# Altium project Jinkono Module.PrjPcb (part 1 of 2)
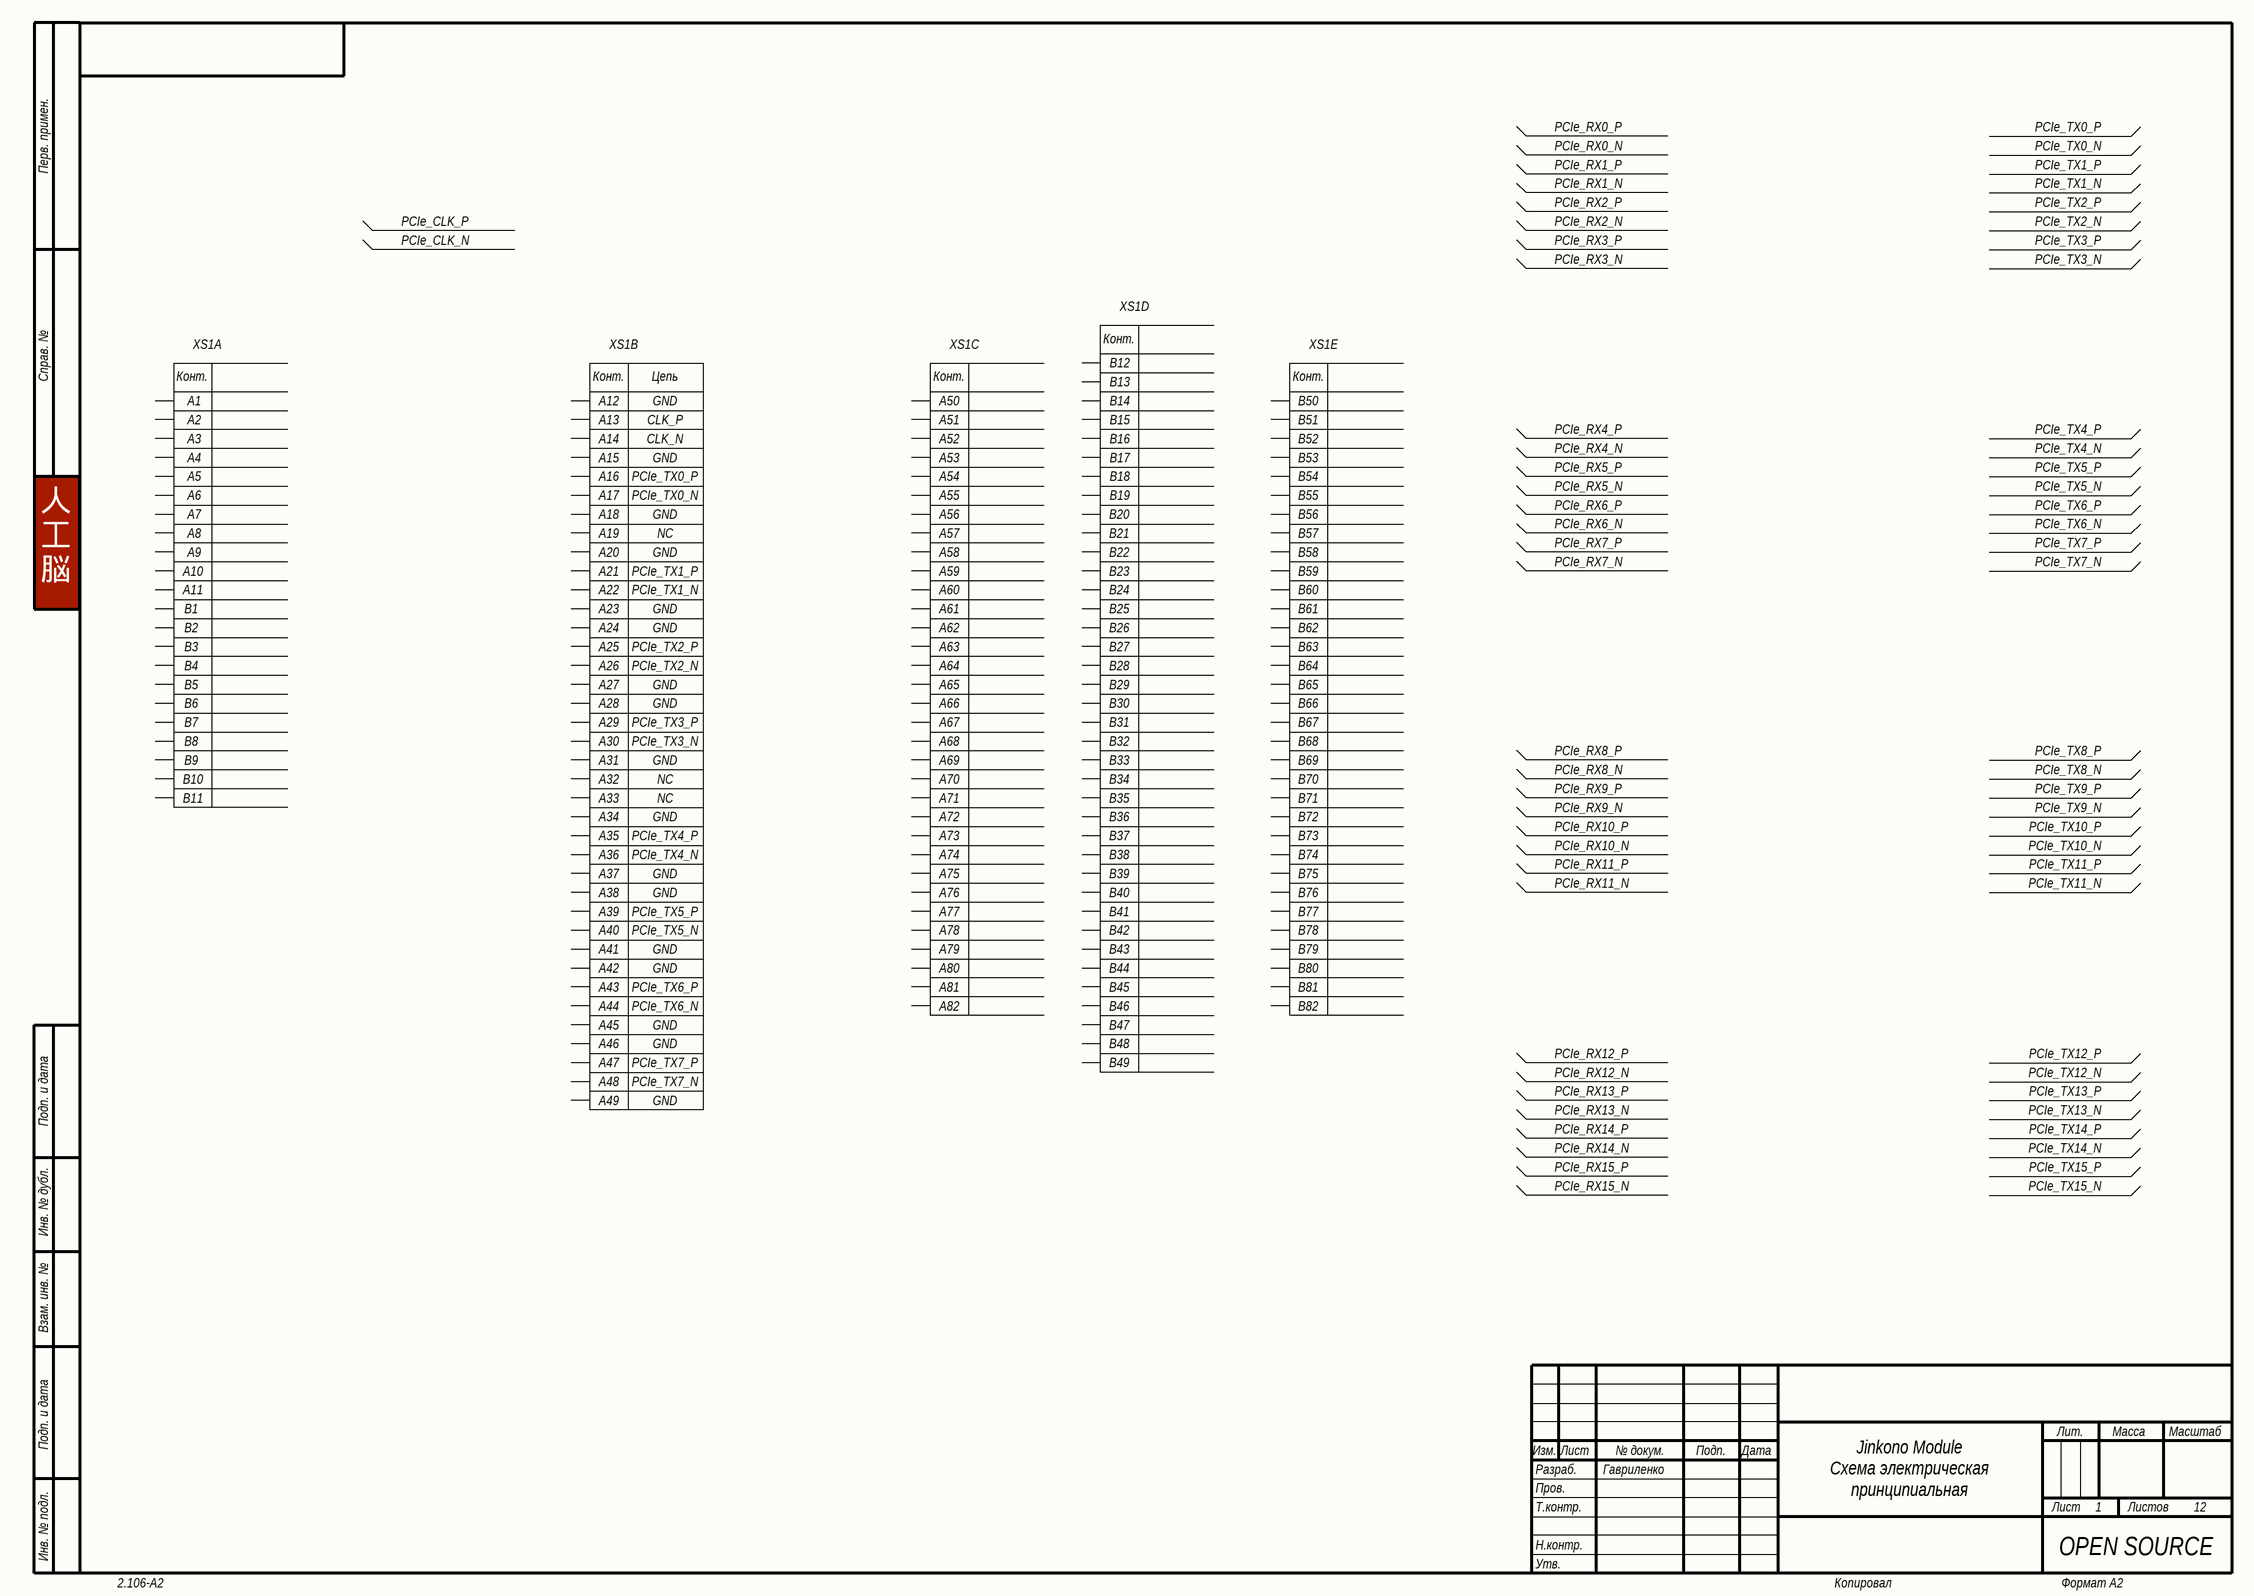
[diagram p0: Э3-1.SchDoc]
11 sheets, 157 parts. Net scope: global (net labels, ports and power ports of the same name join across sheets).
Board file: Jinkono Module вер.0.0.PcbDoc
Sheets:
  Э3-1.SchDoc
  Э3-2.SchDoc
  Э3-3.SchDoc
  Э3-4.SchDoc
  Э3-6.SchDoc
  Э3-7.SchDoc
  Э3-8.SchDoc
  Э3-9.SchDoc
  Э3-10.SchDoc
  Э3-11.SchDoc
  Э3-12.SchDoc

## Sheet Э3-1.SchDoc
size 594 x 420 mm; Author: Гавриленко; CompanyName: OPEN SOURCE; Address1: Address1; Address2: Address2; Address3: Address3; Address4: Address4; SheetNumber: 1; SheetTotal: 12; DocumentType: Схема электрическая принципиальная

### Parts
XS1  1  [PCIe x16 Board Edge Connector]  (value not drawn)  (parts A,B,C,D,E of 5)

### Nets

Not connected (* = marked no-connect by the designer): XS1 A1 A2 A3 A4 A5 A6 A7 A8 A9 A10 A11 A12 A13 A14 A15 A16 A17 A18 A19 A20 A21 A22 A23 A24 A25 A26 A27 A28 A29 A30 A31 A32 A33 A34 A35 A36 A37 A38 A39 A40 A41 A42 A43 A44 A45 A46 A47 A48 A49 A50 A51 A52 A53 A54 A55 A56 A57 A58 A59 A60 A61 A62 A63 A64 A65 A66 A67 A68 A69 A70 A71 A72 A73 A74 A75 A76 A77 A78 A79 A80 A81 A82 B1 B2 B3 B4 B5 B6 B7 B8 B9 B10 B11 B12 B13 B14 B15 B16 B17 B18 B19 B20 B21 B22 B23 B24 B25 B26 B27 B28 B29 B30 B31 B32 B33 B34 B35 B36 B37 B38 B39 B40 B41 B42 B43 B44 B45 B46 B47 B48 B49 B50 B51 B52 B53 B54 B55 B56 B57 B58 B59 B60 B61 B62 B63 B64 B65 B66 B67 B68 B69 B70 B71 B72 B73 B74 B75 B76 B77 B78 B79 B80 B81 B82

### Notes on the sheet
- GND
- Цепь
- CLK_P
- CLK_N
- PCIe_TX0_P
- PCIe_TX0_N
- NC
- PCIe_TX1_P
- PCIe_TX1_N
- 人
  工
  脳
- PCIe_TX2_P
- PCIe_TX2_N
- PCIe_TX3_P
- PCIe_TX3_N
- PCIe_TX4_P
- PCIe_TX4_N
- PCIe_TX5_P
- PCIe_TX5_N
- PCIe_TX6_P
- PCIe_TX6_N
- PCIe_TX7_P
- PCIe_TX7_N
- Jinkono Module
  Схема электрическая
  принципиальная
- Перв. примен.
- Справ. №
- Подп. и дата
- Инв. № дубл.
- Взам. инв. №
- Разраб.
- Изм.
- Лист
- № докум.
- Подп.
- Дата
- Лит.
- Масса
- Масштаб
- Пров.
- Т.контр.
- Листов
- Инв. № подл.
- Утв.
- Н.контр.
- 2.106-A2
- Копировал
- Формат А2
- (in symbol XP_PCe_x16, part A) Конт.
- (in symbol XP_PCe_x16, part B) Конт.
- (in symbol XP_PCe_x16, part C) Конт.
- (in symbol XP_PCe_x16, part D) Конт.
- (in symbol XP_PCe_x16, part E) Конт.

### Library data of the parts
XS1 = XP_PCe_x16: TemperatureRange: -...+°C; ComponentType: Вилка; Install: 1

## Sheet Э3-2.SchDoc
size 594 x 420 mm; Address1: Address1; Address2: Address2; Address3: Address3; Address4: Address4; SheetNumber: 2; SheetTotal: 12; DocumentType: Схема электрическая принципиальная; FirstReferrence: АБВГ.123456.001
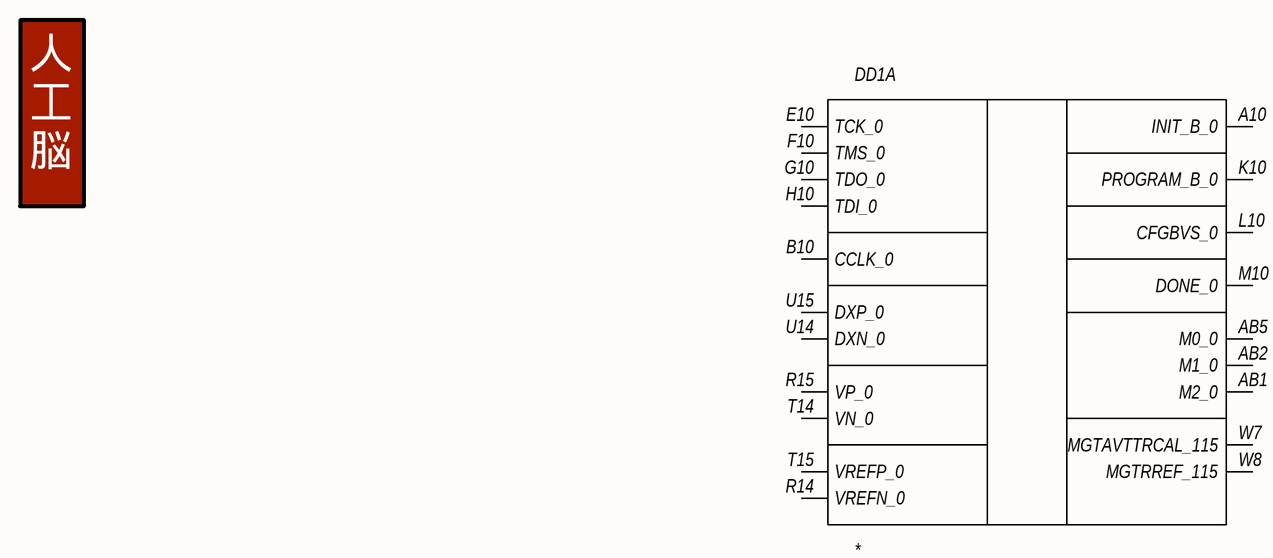
[diagram p1: Э3-2.SchDoc]

### Parts
DD1  *  [FF900/FFG900]  (value not drawn)  (part A of 19)

### Nets

Not connected (* = marked no-connect by the designer): DD1 A10(INIT_B_0) AB1(M2_0) AB2(M1_0) AB5(M0_0) B10(CCLK_0) E10(TCK_0) F10(TMS_0) G10(TDO_0) H10(TDI_0) K10(PROGRAM_B_0) L10(CFGBVS_0) M10(DONE_0) R14(VREFN_0) R15(VP_0) T14(VN_0) T15(VREFP_0) U14(DXN_0) U15(DXP_0) W7(MGTAVTTRCAL_115) W8(MGTRREF_115)

### Notes on the sheet
- 人
  工
  脳
- Перв. примен.
- Справ. №
- Подп. и дата
- Инв. № дубл.
- Взам. инв. №
- Инв. № подл.
- Изм.
- Лист
- № докум.
- Подп.
- Дата
- 2.106-A2
- Копировал
- Формат А2

### Library data of the parts
DD1 = XC7K325T-XFFG900: Kintex-7 FPGA; Manufacturer: Xilinx Inc.; TemperatureRange: -XX...+XX°C; Package: 900-FFG; ComponentType: IC; DatasheetURL: *; HelpURL: *; PinCount: 900; PartNumber: *

## Sheet Э3-3.SchDoc
size 594 x 420 mm; Address1: Address1; Address2: Address2; Address3: Address3; Address4: Address4; SheetNumber: 3; SheetTotal: 12; DocumentType: Схема электрическая принципиальная
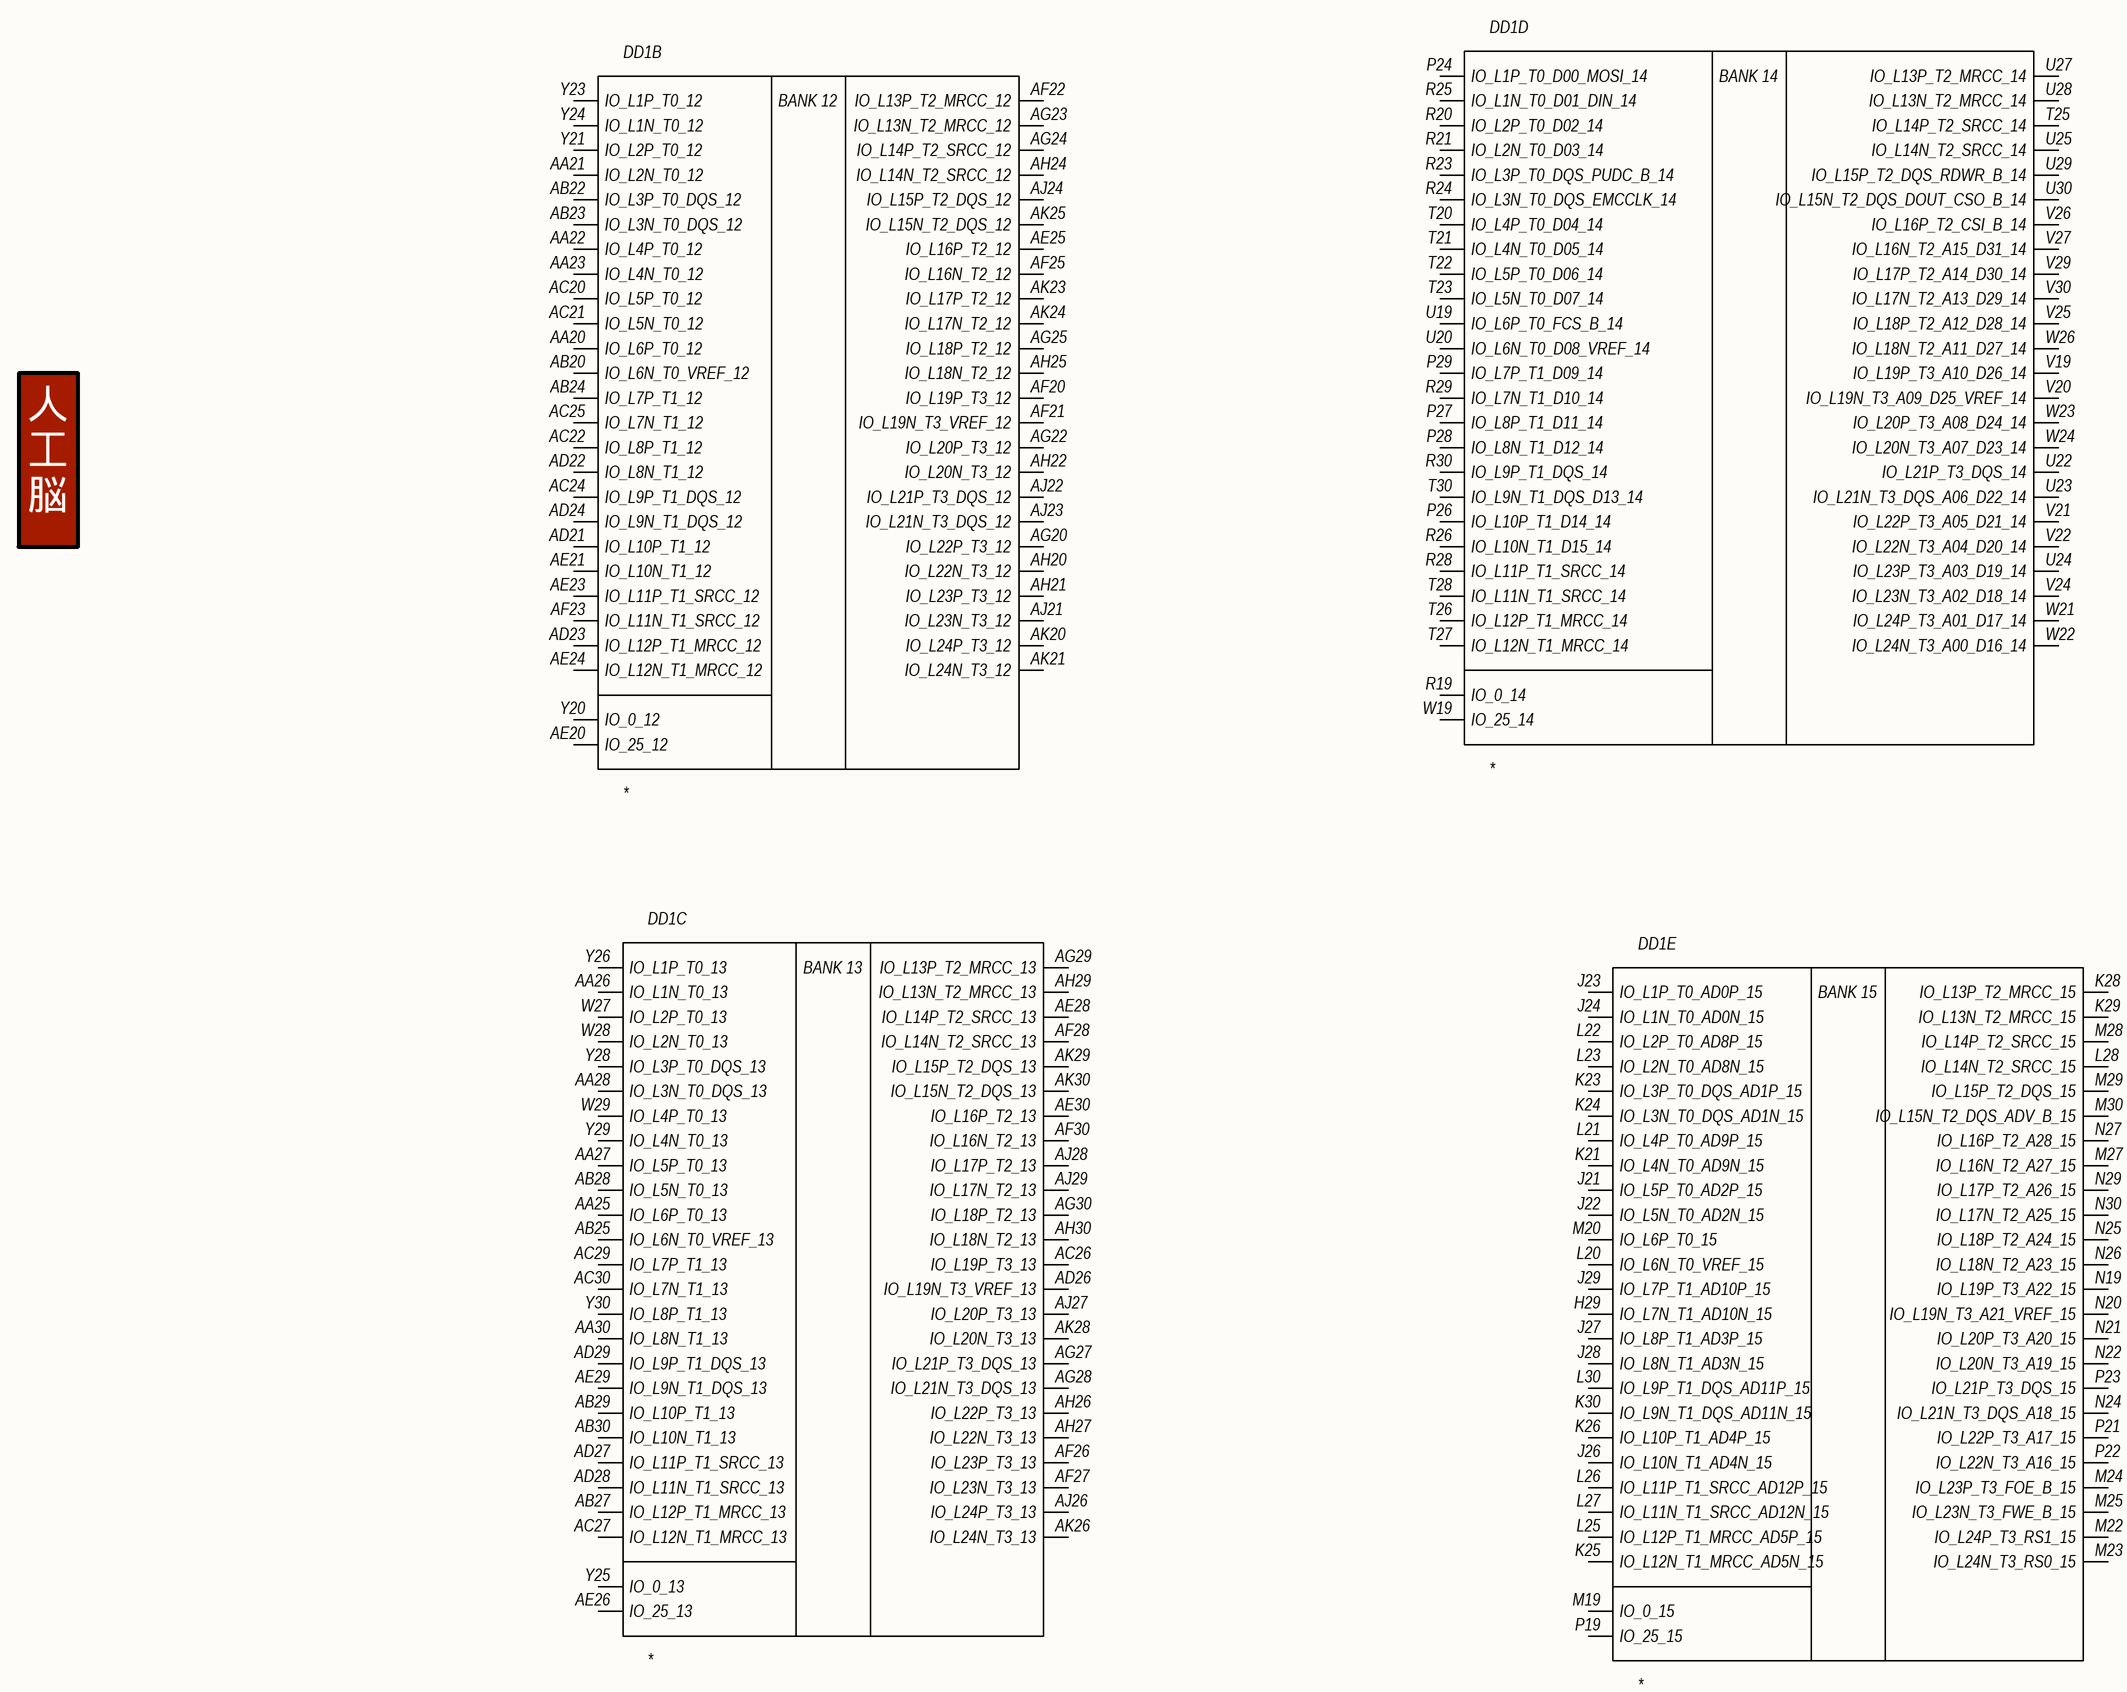
[diagram p2: Э3-3.SchDoc]

### Parts
DD1  *  [FF900/FFG900]  (value not drawn)  (parts B,C,D,E of 19)

### Nets

Not connected (* = marked no-connect by the designer): DD1 AA20(IO_L6P_T0_12) AA21(IO_L2N_T0_12) AA22(IO_L4P_T0_12) AA23(IO_L4N_T0_12) AA25(IO_L6P_T0_13) AA26(IO_L1N_T0_13) AA27(IO_L5P_T0_13) AA28(IO_L3N_T0_DQS_13) AA30(IO_L8N_T1_13) AB20(IO_L6N_T0_VREF_12) AB22(IO_L3P_T0_DQS_12) AB23(IO_L3N_T0_DQS_12) AB24(IO_L7P_T1_12) AB25(IO_L6N_T0_VREF_13) AB27(IO_L12P_T1_MRCC_13) AB28(IO_L5N_T0_13) AB29(IO_L10P_T1_13) AB30(IO_L10N_T1_13) AC20(IO_L5P_T0_12) AC21(IO_L5N_T0_12) AC22(IO_L8P_T1_12) AC24(IO_L9P_T1_DQS_12) AC25(IO_L7N_T1_12) AC26(IO_L19P_T3_13) AC27(IO_L12N_T1_MRCC_13) AC29(IO_L7P_T1_13) AC30(IO_L7N_T1_13) AD21(IO_L10P_T1_12) AD22(IO_L8N_T1_12) AD23(IO_L12P_T1_MRCC_12) AD24(IO_L9N_T1_DQS_12) AD26(IO_L19N_T3_VREF_13) AD27(IO_L11P_T1_SRCC_13) AD28(IO_L11N_T1_SRCC_13) AD29(IO_L9P_T1_DQS_13) AE20(IO_25_12) AE21(IO_L10N_T1_12) AE23(IO_L11P_T1_SRCC_12) AE24(IO_L12N_T1_MRCC_12) AE25(IO_L16P_T2_12) AE26(IO_25_13) AE28(IO_L14P_T2_SRCC_13) AE29(IO_L9N_T1_DQS_13) AE30(IO_L16P_T2_13) AF20(IO_L19P_T3_12) AF21(IO_L19N_T3_VREF_12) AF22(IO_L13P_T2_MRCC_12) AF23(IO_L11N_T1_SRCC_12) AF25(IO_L16N_T2_12) AF26(IO_L23P_T3_13) AF27(IO_L23N_T3_13) AF28(IO_L14N_T2_SRCC_13) AF30(IO_L16N_T2_13) AG20(IO_L22P_T3_12) AG22(IO_L20P_T3_12) AG23(IO_L13N_T2_MRCC_12) AG24(IO_L14P_T2_SRCC_12) AG25(IO_L18P_T2_12) AG27(IO_L21P_T3_DQS_13) AG28(IO_L21N_T3_DQS_13) AG29(IO_L13P_T2_MRCC_13) AG30(IO_L18P_T2_13) AH20(IO_L22N_T3_12) AH21(IO_L23P_T3_12) AH22(IO_L20N_T3_12) AH24(IO_L14N_T2_SRCC_12) AH25(IO_L18N_T2_12) AH26(IO_L22P_T3_13) AH27(IO_L22N_T3_13) AH29(IO_L13N_T2_MRCC_13) AH30(IO_L18N_T2_13) AJ21(IO_L23N_T3_12) AJ22(IO_L21P_T3_DQS_12) AJ23(IO_L21N_T3_DQS_12) AJ24(IO_L15P_T2_DQS_12) AJ26(IO_L24P_T3_13) AJ27(IO_L20P_T3_13) AJ28(IO_L17P_T2_13) AJ29(IO_L17N_T2_13) AK20(IO_L24P_T3_12) AK21(IO_L24N_T3_12) AK23(IO_L17P_T2_12) AK24(IO_L17N_T2_12) AK25(IO_L15N_T2_DQS_12) AK26(IO_L24N_T3_13) AK28(IO_L20N_T3_13) AK29(IO_L15P_T2_DQS_13) AK30(IO_L15N_T2_DQS_13) H29(IO_L7N_T1_AD10N_15) J21(IO_L5P_T0_AD2P_15) J22(IO_L5N_T0_AD2N_15) J23(IO_L1P_T0_AD0P_15) J24(IO_L1N_T0_AD0N_15) J26(IO_L10N_T1_AD4N_15) J27(IO_L8P_T1_AD3P_15) J28(IO_L8N_T1_AD3N_15) J29(IO_L7P_T1_AD10P_15) K21(IO_L4N_T0_AD9N_15) K23(IO_L3P_T0_DQS_AD1P_15) K24(IO_L3N_T0_DQS_AD1N_15) K25(IO_L12N_T1_MRCC_AD5N_15) K26(IO_L10P_T1_AD4P_15) K28(IO_L13P_T2_MRCC_15) K29(IO_L13N_T2_MRCC_15) K30(IO_L9N_T1_DQS_AD11N_15) L20(IO_L6N_T0_VREF_15) L21(IO_L4P_T0_AD9P_15) L22(IO_L2P_T0_AD8P_15) L23(IO_L2N_T0_AD8N_15) L25(IO_L12P_T1_MRCC_AD5P_15) L26(IO_L11P_T1_SRCC_AD12P_15) L27(IO_L11N_T1_SRCC_AD12N_15) L28(IO_L14N_T2_SRCC_15) L30(IO_L9P_T1_DQS_AD11P_15) M19(IO_0_15) M20(IO_L6P_T0_15) M22(IO_L24P_T3_RS1_15) M23(IO_L24N_T3_RS0_15) M24(IO_L23P_T3_FOE_B_15) M25(IO_L23N_T3_FWE_B_15) M27(IO_L16N_T2_A27_15) M28(IO_L14P_T2_SRCC_15) M29(IO_L15P_T2_DQS_15) M30(IO_L15N_T2_DQS_ADV_B_15) N19(IO_L19P_T3_A22_15) N20(IO_L19N_T3_A21_VREF_15) N21(IO_L20P_T3_A20_15) N22(IO_L20N_T3_A19_15) N24(IO_L21N_T3_DQS_A18_15) N25(IO_L18P_T2_A24_15) N26(IO_L18N_T2_A23_15) N27(IO_L16P_T2_A28_15) N29(IO_L17P_T2_A26_15) N30(IO_L17N_T2_A25_15) P19(IO_25_15) P21(IO_L22P_T3_A17_15) P22(IO_L22N_T3_A16_15) P23(IO_L21P_T3_DQS_15) P24(IO_L1P_T0_D00_MOSI_14) P26(IO_L10P_T1_D14_14) P27(IO_L8P_T1_D11_14) P28(IO_L8N_T1_D12_14) P29(IO_L7P_T1_D09_14) R19(IO_0_14) R20(IO_L2P_T0_D02_14) R21(IO_L2N_T0_D03_14) R23(IO_L3P_T0_DQS_PUDC_B_14) R24(IO_L3N_T0_DQS_EMCCLK_14) R25(IO_L1N_T0_D01_DIN_14) R26(IO_L10N_T1_D15_14) R28(IO_L11P_T1_SRCC_14) R29(IO_L7N_T1_D10_14) R30(IO_L9P_T1_DQS_14) T20(IO_L4P_T0_D04_14) T21(IO_L4N_T0_D05_14) T22(IO_L5P_T0_D06_14) T23(IO_L5N_T0_D07_14) T25(IO_L14P_T2_SRCC_14) T26(IO_L12P_T1_MRCC_14) T27(IO_L12N_T1_MRCC_14) T28(IO_L11N_T1_SRCC_14) T30(IO_L9N_T1_DQS_D13_14) U19(IO_L6P_T0_FCS_B_14) U20(IO_L6N_T0_D08_VREF_14) U22(IO_L21P_T3_DQS_14) U23(IO_L21N_T3_DQS_A06_D22_14) U24(IO_L23P_T3_A03_D19_14) U25(IO_L14N_T2_SRCC_14) U27(IO_L13P_T2_MRCC_14) U28(IO_L13N_T2_MRCC_14) U29(IO_L15P_T2_DQS_RDWR_B_14) U30(IO_L15N_T2_DQS_DOUT_CSO_B_14) V19(IO_L19P_T3_A10_D26_14) V20(IO_L19N_T3_A09_D25_VREF_14) V21(IO_L22P_T3_A05_D21_14) V22(IO_L22N_T3_A04_D20_14) V24(IO_L23N_T3_A02_D18_14) V25(IO_L18P_T2_A12_D28_14) V26(IO_L16P_T2_CSI_B_14) V27(IO_L16N_T2_A15_D31_14) V29(IO_L17P_T2_A14_D30_14) V30(IO_L17N_T2_A13_D29_14) W19(IO_25_14) W21(IO_L24P_T3_A01_D17_14) W22(IO_L24N_T3_A00_D16_14) W23(IO_L20P_T3_A08_D24_14) W24(IO_L20N_T3_A07_D23_14) W26(IO_L18N_T2_A11_D27_14) W27(IO_L2P_T0_13) W28(IO_L2N_T0_13) W29(IO_L4P_T0_13) Y20(IO_0_12) Y21(IO_L2P_T0_12) Y23(IO_L1P_T0_12) Y24(IO_L1N_T0_12) Y25(IO_0_13) Y26(IO_L1P_T0_13) Y28(IO_L3P_T0_DQS_13) Y29(IO_L4N_T0_13) Y30(IO_L8P_T1_13)

### Notes on the sheet
- 人
  工
  脳
- Перв. примен.
- Справ. №
- Подп. и дата
- Инв. № дубл.
- Взам. инв. №
- Инв. № подл.
- Изм.
- Лист
- № докум.
- Подп.
- Дата
- 2.106-A2
- Копировал
- Формат А2
- (in symbol XC7K325T-XFFG900, part B) BANK 12
- (in symbol XC7K325T-XFFG900, part C) BANK 13
- (in symbol XC7K325T-XFFG900, part D) BANK 14
- (in symbol XC7K325T-XFFG900, part E) BANK 15

### Library data of the parts
DD1 = XC7K325T-XFFG900: as DD1 on sheet Э3-2; Package: 900-FFG; ComponentType: IC; DatasheetURL: *; HelpURL: *; PinCount: 900; PartNumber: *

## Sheet Э3-4.SchDoc
size 594 x 420 mm; Address1: Address1; Address2: Address2; Address3: Address3; Address4: Address4; SheetNumber: 4; SheetTotal: 12; DocumentType: Схема электрическая принципиальная
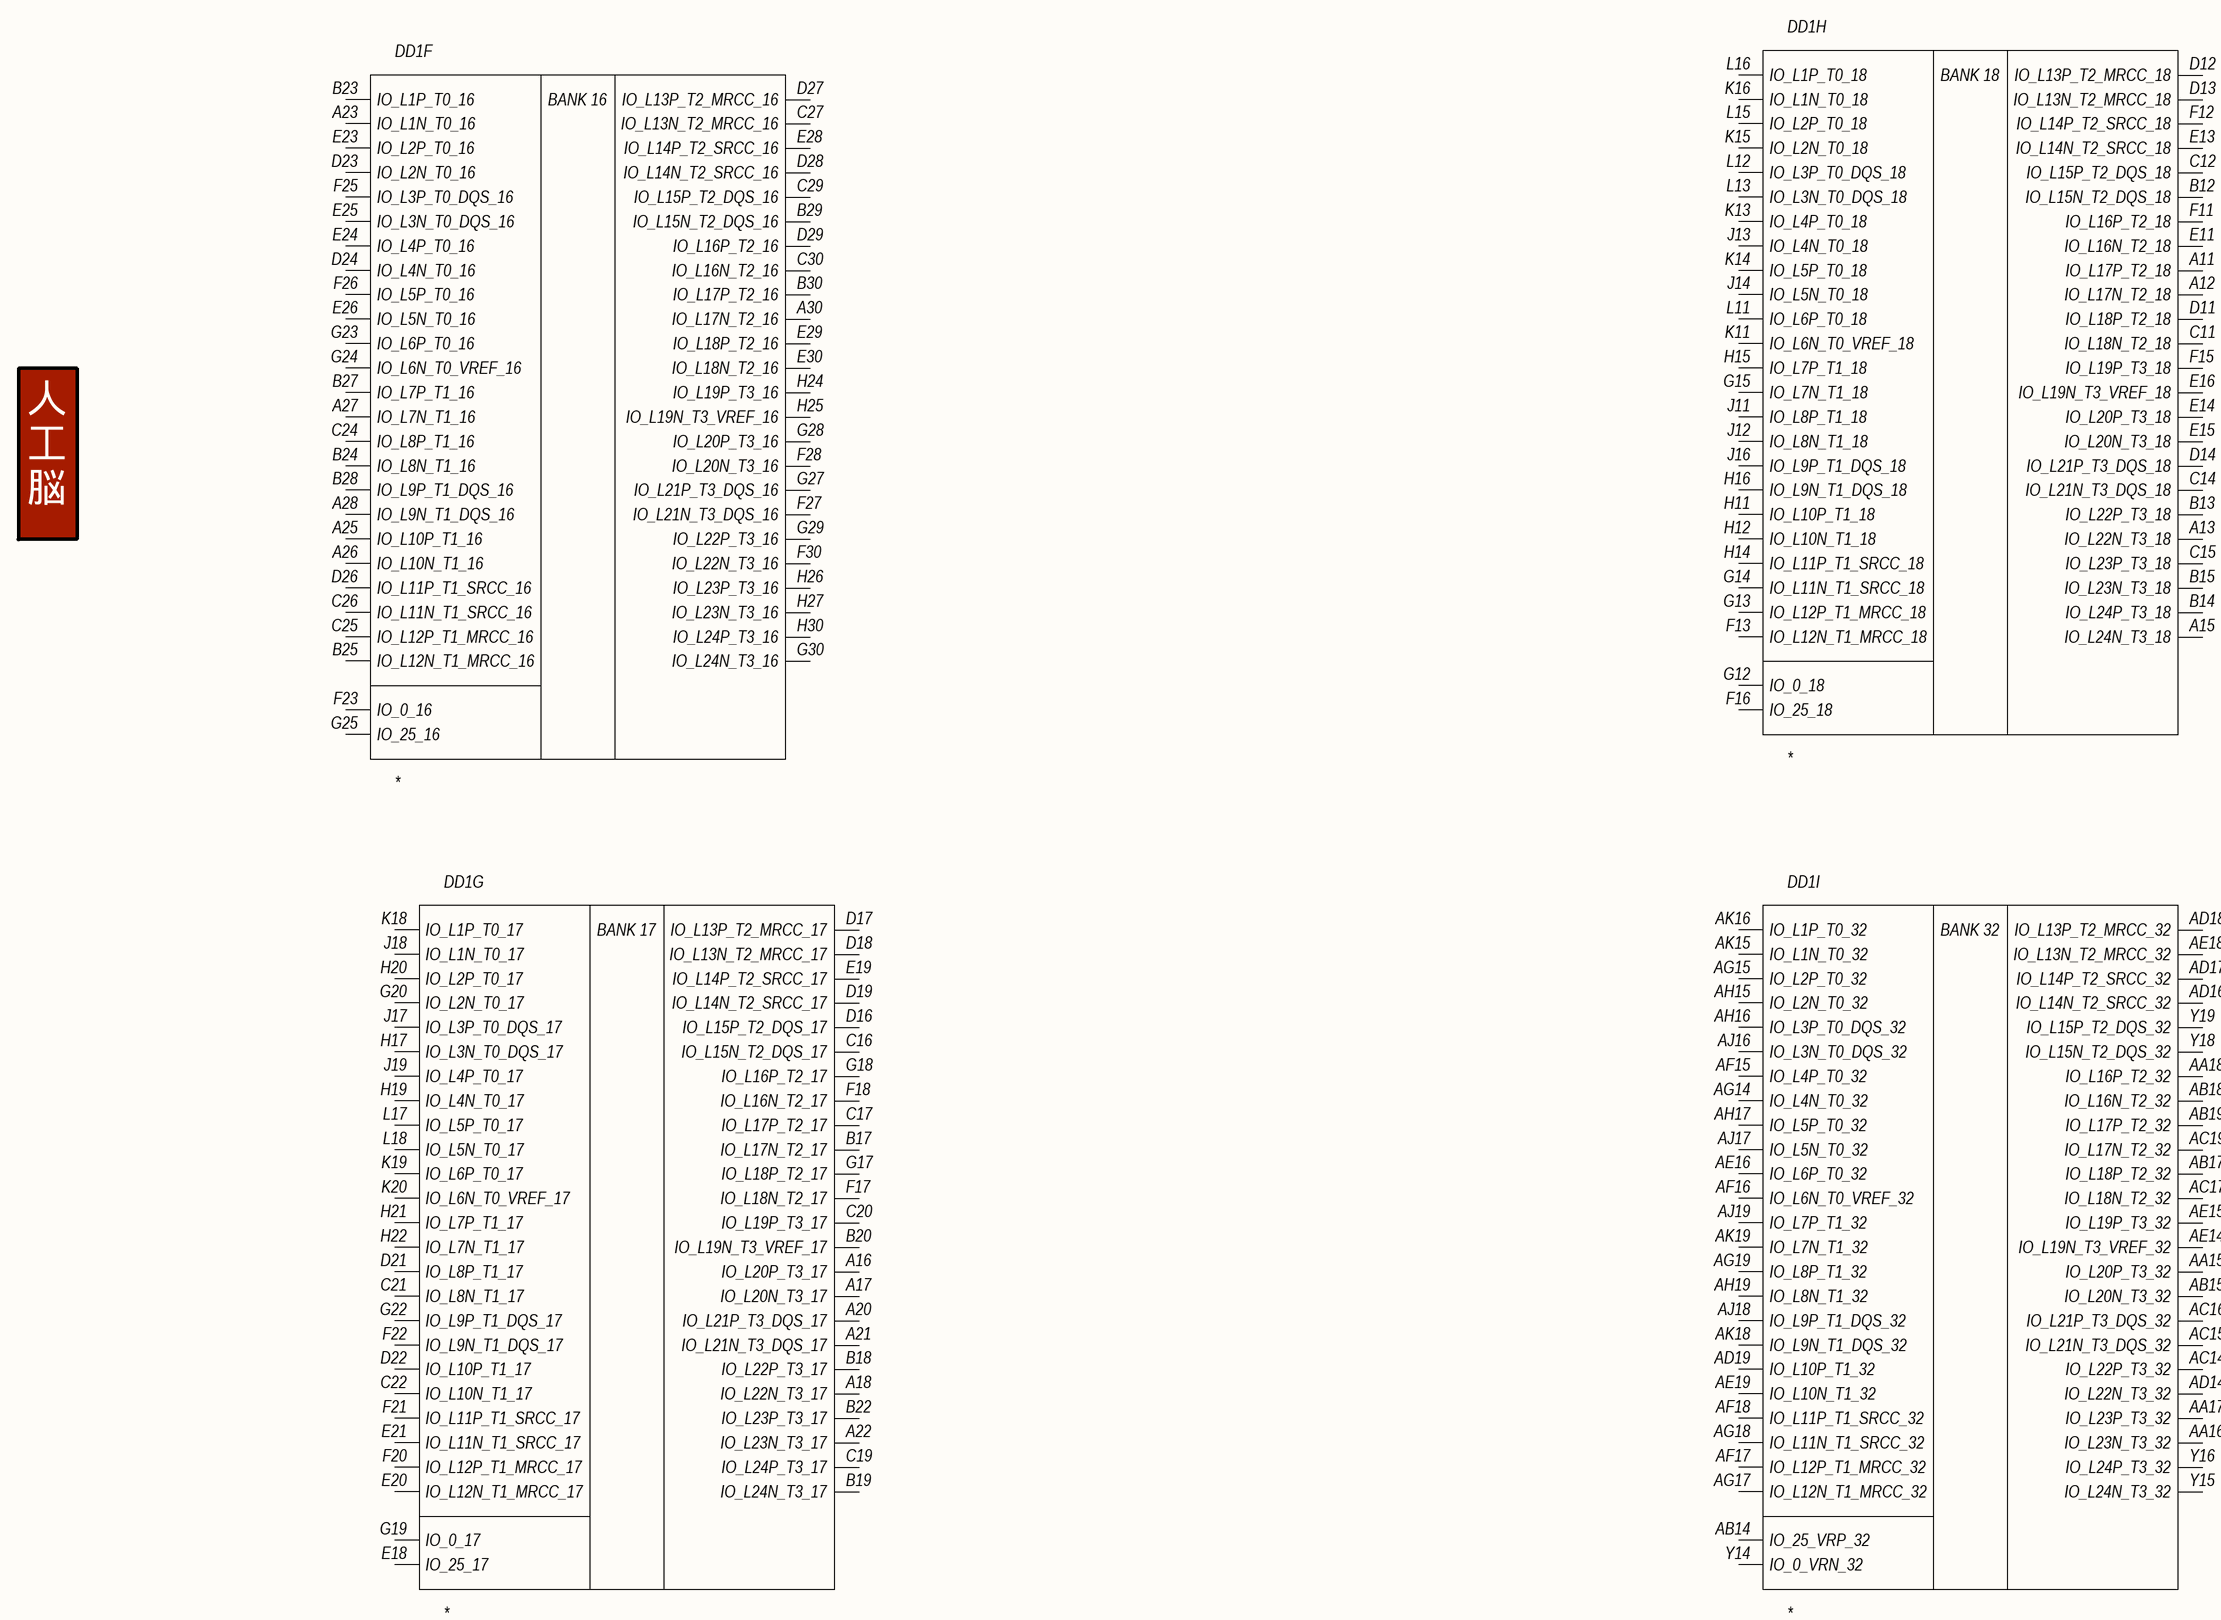
[diagram p3: Э3-4.SchDoc]

### Parts
DD1  *  [FF900/FFG900]  (value not drawn)  (parts F,G,H,I of 19)

### Nets

Not connected (* = marked no-connect by the designer): DD1 A11(IO_L17P_T2_18) A12(IO_L17N_T2_18) A13(IO_L22N_T3_18) A15(IO_L24N_T3_18) A16(IO_L20P_T3_17) A17(IO_L20N_T3_17) A18(IO_L22N_T3_17) A20(IO_L21P_T3_DQS_17) A21(IO_L21N_T3_DQS_17) A22(IO_L23N_T3_17) A23(IO_L1N_T0_16) A25(IO_L10P_T1_16) A26(IO_L10N_T1_16) A27(IO_L7N_T1_16) A28(IO_L9N_T1_DQS_16) A30(IO_L17N_T2_16) AA15(IO_L20P_T3_32) AA16(IO_L23N_T3_32) AA17(IO_L23P_T3_32) AA18(IO_L16P_T2_32) AB14(IO_25_VRP_32) AB15(IO_L20N_T3_32) AB17(IO_L18P_T2_32) AB18(IO_L16N_T2_32) AB19(IO_L17P_T2_32) AC14(IO_L22P_T3_32) AC15(IO_L21N_T3_DQS_32) AC16(IO_L21P_T3_DQS_32) AC17(IO_L18N_T2_32) AC19(IO_L17N_T2_32) AD14(IO_L22N_T3_32) AD16(IO_L14N_T2_SRCC_32) AD17(IO_L14P_T2_SRCC_32) AD18(IO_L13P_T2_MRCC_32) AD19(IO_L10P_T1_32) AE14(IO_L19N_T3_VREF_32) AE15(IO_L19P_T3_32) AE16(IO_L6P_T0_32) AE18(IO_L13N_T2_MRCC_32) AE19(IO_L10N_T1_32) AF15(IO_L4P_T0_32) AF16(IO_L6N_T0_VREF_32) AF17(IO_L12P_T1_MRCC_32) AF18(IO_L11P_T1_SRCC_32) AG14(IO_L4N_T0_32) AG15(IO_L2P_T0_32) AG17(IO_L12N_T1_MRCC_32) AG18(IO_L11N_T1_SRCC_32) AG19(IO_L8P_T1_32) AH15(IO_L2N_T0_32) AH16(IO_L3P_T0_DQS_32) AH17(IO_L5P_T0_32) AH19(IO_L8N_T1_32) AJ16(IO_L3N_T0_DQS_32) AJ17(IO_L5N_T0_32) AJ18(IO_L9P_T1_DQS_32) AJ19(IO_L7P_T1_32) AK15(IO_L1N_T0_32) AK16(IO_L1P_T0_32) AK18(IO_L9N_T1_DQS_32) AK19(IO_L7N_T1_32) B12(IO_L15N_T2_DQS_18) B13(IO_L22P_T3_18) B14(IO_L24P_T3_18) B15(IO_L23N_T3_18) B17(IO_L17N_T2_17) B18(IO_L22P_T3_17) B19(IO_L24N_T3_17) B20(IO_L19N_T3_VREF_17) B22(IO_L23P_T3_17) B23(IO_L1P_T0_16) B24(IO_L8N_T1_16) B25(IO_L12N_T1_MRCC_16) B27(IO_L7P_T1_16) B28(IO_L9P_T1_DQS_16) B29(IO_L15N_T2_DQS_16) B30(IO_L17P_T2_16) C11(IO_L18N_T2_18) C12(IO_L15P_T2_DQS_18) C14(IO_L21N_T3_DQS_18) C15(IO_L23P_T3_18) C16(IO_L15N_T2_DQS_17) C17(IO_L17P_T2_17) C19(IO_L24P_T3_17) C20(IO_L19P_T3_17) C21(IO_L8N_T1_17) C22(IO_L10N_T1_17) C24(IO_L8P_T1_16) C25(IO_L12P_T1_MRCC_16) C26(IO_L11N_T1_SRCC_16) C27(IO_L13N_T2_MRCC_16) C29(IO_L15P_T2_DQS_16) C30(IO_L16N_T2_16) D11(IO_L18P_T2_18) D12(IO_L13P_T2_MRCC_18) D13(IO_L13N_T2_MRCC_18) D14(IO_L21P_T3_DQS_18) D16(IO_L15P_T2_DQS_17) D17(IO_L13P_T2_MRCC_17) D18(IO_L13N_T2_MRCC_17) D19(IO_L14N_T2_SRCC_17) D21(IO_L8P_T1_17) D22(IO_L10P_T1_17) D23(IO_L2N_T0_16) D24(IO_L4N_T0_16) D26(IO_L11P_T1_SRCC_16) D27(IO_L13P_T2_MRCC_16) D28(IO_L14N_T2_SRCC_16) D29(IO_L16P_T2_16) E11(IO_L16N_T2_18) E13(IO_L14N_T2_SRCC_18) E14(IO_L20P_T3_18) E15(IO_L20N_T3_18) E16(IO_L19N_T3_VREF_18) E18(IO_25_17) E19(IO_L14P_T2_SRCC_17) E20(IO_L12N_T1_MRCC_17) E21(IO_L11N_T1_SRCC_17) E23(IO_L2P_T0_16) E24(IO_L4P_T0_16) E25(IO_L3N_T0_DQS_16) E26(IO_L5N_T0_16) E28(IO_L14P_T2_SRCC_16) E29(IO_L18P_T2_16) E30(IO_L18N_T2_16) F11(IO_L16P_T2_18) F12(IO_L14P_T2_SRCC_18) F13(IO_L12N_T1_MRCC_18) F15(IO_L19P_T3_18) F16(IO_25_18) F17(IO_L18N_T2_17) F18(IO_L16N_T2_17) F20(IO_L12P_T1_MRCC_17) F21(IO_L11P_T1_SRCC_17) F22(IO_L9N_T1_DQS_17) F23(IO_0_16) F25(IO_L3P_T0_DQS_16) F26(IO_L5P_T0_16) F27(IO_L21N_T3_DQS_16) F28(IO_L20N_T3_16) F30(IO_L22N_T3_16) G12(IO_0_18) G13(IO_L12P_T1_MRCC_18) G14(IO_L11N_T1_SRCC_18) G15(IO_L7N_T1_18) G17(IO_L18P_T2_17) G18(IO_L16P_T2_17) G19(IO_0_17) G20(IO_L2N_T0_17) G22(IO_L9P_T1_DQS_17) G23(IO_L6P_T0_16) G24(IO_L6N_T0_VREF_16) G25(IO_25_16) G27(IO_L21P_T3_DQS_16) G28(IO_L20P_T3_16) G29(IO_L22P_T3_16) G30(IO_L24N_T3_16) H11(IO_L10P_T1_18) H12(IO_L10N_T1_18) H14(IO_L11P_T1_SRCC_18) H15(IO_L7P_T1_18) H16(IO_L9N_T1_DQS_18) H17(IO_L3N_T0_DQS_17) H19(IO_L4N_T0_17) H20(IO_L2P_T0_17) H21(IO_L7P_T1_17) H22(IO_L7N_T1_17) H24(IO_L19P_T3_16) H25(IO_L19N_T3_VREF_16) H26(IO_L23P_T3_16) H27(IO_L23N_T3_16) H30(IO_L24P_T3_16) J11(IO_L8P_T1_18) J12(IO_L8N_T1_18) J13(IO_L4N_T0_18) J14(IO_L5N_T0_18) J16(IO_L9P_T1_DQS_18) J17(IO_L3P_T0_DQS_17) J18(IO_L1N_T0_17) J19(IO_L4P_T0_17) K11(IO_L6N_T0_VREF_18) K13(IO_L4P_T0_18) K14(IO_L5P_T0_18) K15(IO_L2N_T0_18) K16(IO_L1N_T0_18) K18(IO_L1P_T0_17) K19(IO_L6P_T0_17) K20(IO_L6N_T0_VREF_17) L11(IO_L6P_T0_18) L12(IO_L3P_T0_DQS_18) L13(IO_L3N_T0_DQS_18) L15(IO_L2P_T0_18) L16(IO_L1P_T0_18) L17(IO_L5P_T0_17) L18(IO_L5N_T0_17) Y14(IO_0_VRN_32) Y15(IO_L24N_T3_32) Y16(IO_L24P_T3_32) Y18(IO_L15N_T2_DQS_32) Y19(IO_L15P_T2_DQS_32)

### Notes on the sheet
- 人
  工
  脳
- Перв. примен.
- Справ. №
- Подп. и дата
- Инв. № дубл.
- Взам. инв. №
- Инв. № подл.
- Изм.
- Лист
- № докум.
- Подп.
- Дата
- 2.106-A2
- Копировал
- Формат А2
- (in symbol XC7K325T-XFFG900, part F) BANK 16
- (in symbol XC7K325T-XFFG900, part G) BANK 17
- (in symbol XC7K325T-XFFG900, part H) BANK 18
- (in symbol XC7K325T-XFFG900, part I) BANK 32

### Library data of the parts
DD1 = XC7K325T-XFFG900: as DD1 on sheet Э3-2; Package: 900-FFG; ComponentType: IC; DatasheetURL: *; HelpURL: *; PinCount: 900; PartNumber: *

## Sheet Э3-6.SchDoc
size 594 x 420 mm; Address1: Address1; Address2: Address2; Address3: Address3; Address4: Address4; SheetNumber: 6; SheetTotal: 12; DocumentType: Схема электрическая принципиальная
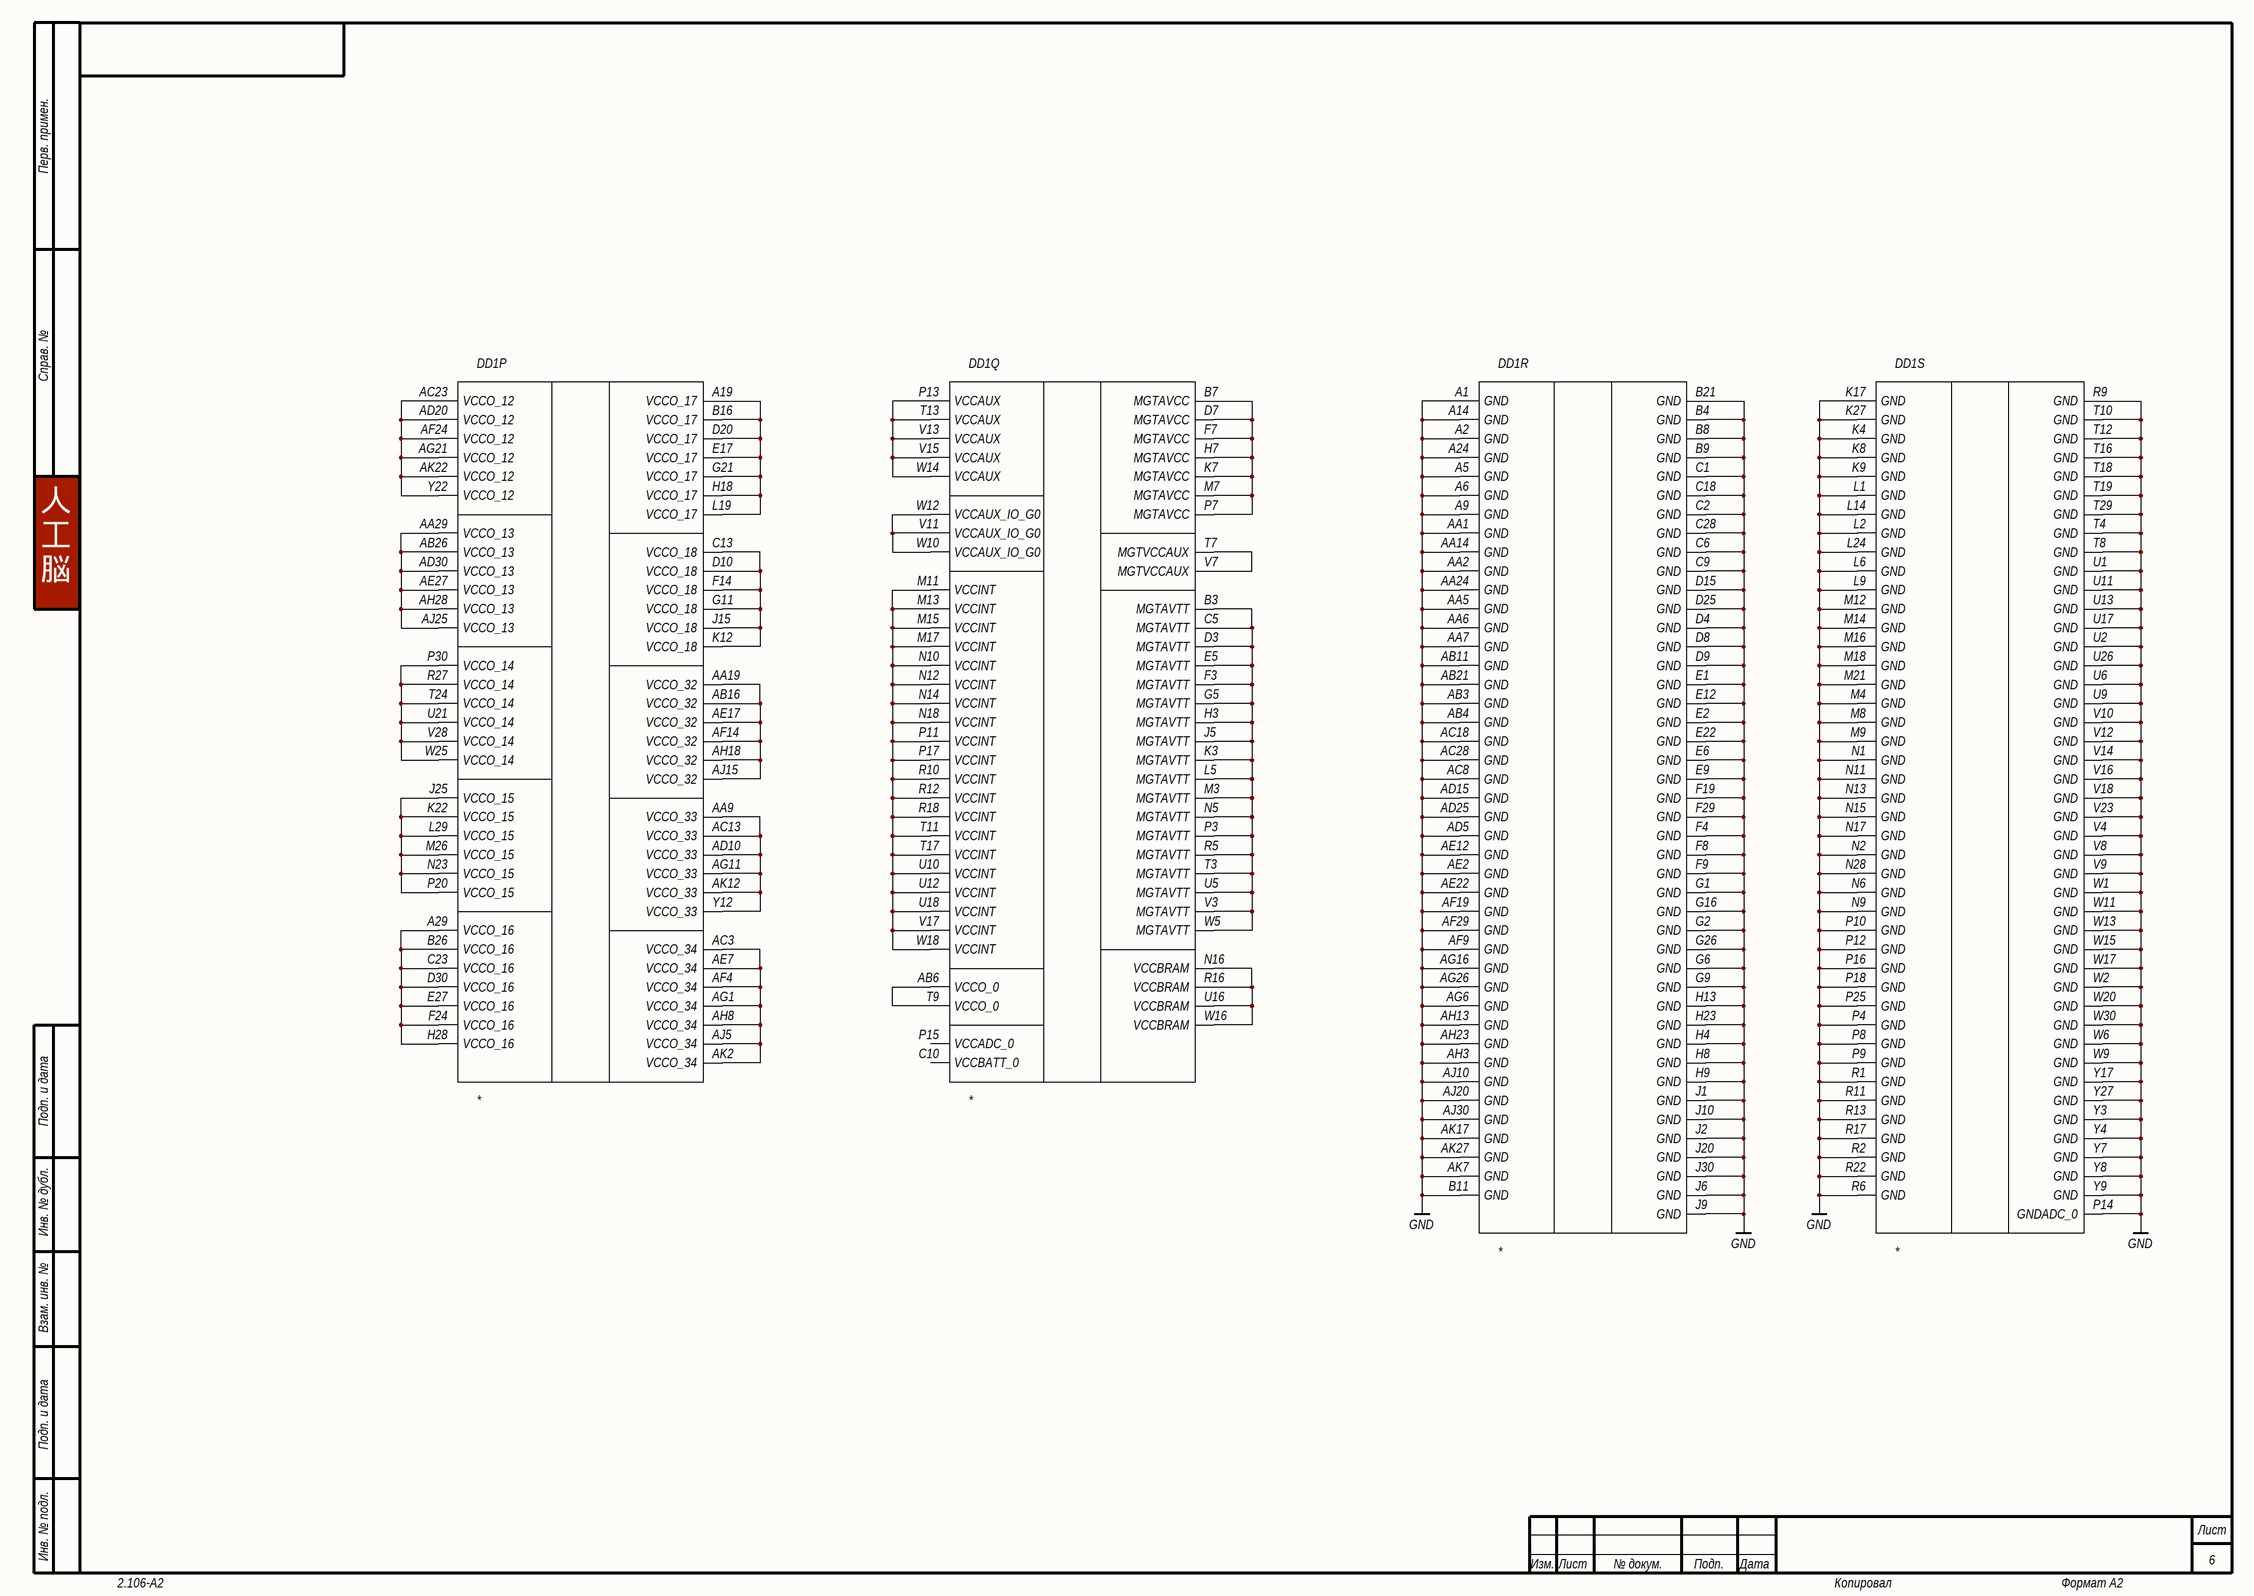
[diagram p4: Э3-6.SchDoc]

### Parts
DD1  *  [FF900/FFG900]  (value not drawn)  (parts P,Q,R,S of 19)

### Nets
GND: DD1.A1(GND) DD1.A2(GND) DD1.A5(GND) DD1.A6(GND) DD1.A9(GND) DD1.A14(GND) DD1.A24(GND) DD1.AA1(GND) DD1.AA2(GND) DD1.AA5(GND) DD1.AA6(GND) DD1.AA7(GND) DD1.AA14(GND) DD1.AA24(GND) DD1.AB3(GND) DD1.AB4(GND) DD1.AB11(GND) DD1.AB21(GND) DD1.AC8(GND) DD1.AC18(GND) DD1.AC28(GND) DD1.AD5(GND) DD1.AD15(GND) DD1.AD25(GND) DD1.AE2(GND) DD1.AE12(GND) DD1.AE22(GND) DD1.AF9(GND) DD1.AF19(GND) DD1.AF29(GND) DD1.AG6(GND) DD1.AG16(GND) DD1.AG26(GND) DD1.AH3(GND) DD1.AH13(GND) DD1.AH23(GND) DD1.AJ10(GND) DD1.AJ20(GND) DD1.AJ30(GND) DD1.AK7(GND) DD1.AK17(GND) DD1.AK27(GND) DD1.B4(GND) DD1.B8(GND) DD1.B9(GND) DD1.B11(GND) DD1.B21(GND) DD1.C1(GND) DD1.C2(GND) DD1.C6(GND) DD1.C9(GND) DD1.C18(GND) DD1.C28(GND) DD1.D4(GND) DD1.D8(GND) DD1.D9(GND) DD1.D15(GND) DD1.D25(GND) DD1.E1(GND) DD1.E2(GND) DD1.E6(GND) DD1.E9(GND) DD1.E12(GND) DD1.E22(GND) DD1.F4(GND) DD1.F8(GND) DD1.F9(GND) DD1.F19(GND) DD1.F29(GND) DD1.G1(GND) DD1.G2(GND) DD1.G6(GND) DD1.G9(GND) DD1.G16(GND) DD1.G26(GND) DD1.H4(GND) DD1.H8(GND) DD1.H9(GND) DD1.H13(GND) DD1.H23(GND) DD1.J1(GND) DD1.J2(GND) DD1.J6(GND) DD1.J9(GND) DD1.J10(GND) DD1.J20(GND) DD1.J30(GND) DD1.K4(GND) DD1.K8(GND) DD1.K9(GND) DD1.K17(GND) DD1.K27(GND) DD1.L1(GND) DD1.L2(GND) DD1.L6(GND) DD1.L9(GND) DD1.L14(GND) DD1.L24(GND) DD1.M4(GND) DD1.M8(GND) DD1.M9(GND) DD1.M12(GND) DD1.M14(GND) DD1.M16(GND) DD1.M18(GND) DD1.M21(GND) DD1.N1(GND) DD1.N2(GND) DD1.N6(GND) DD1.N9(GND) DD1.N11(GND) DD1.N13(GND) DD1.N15(GND) DD1.N17(GND) DD1.N28(GND) DD1.P4(GND) DD1.P8(GND) DD1.P9(GND) DD1.P10(GND) DD1.P12(GND) DD1.P14(GNDADC_0) DD1.P16(GND) DD1.P18(GND) DD1.P25(GND) DD1.R1(GND) DD1.R2(GND) DD1.R6(GND) DD1.R9(GND) DD1.R11(GND) DD1.R13(GND) DD1.R17(GND) DD1.R22(GND) DD1.T4(GND) DD1.T8(GND) DD1.T10(GND) DD1.T12(GND) DD1.T16(GND) DD1.T18(GND) DD1.T19(GND) DD1.T29(GND) DD1.U1(GND) DD1.U2(GND) DD1.U6(GND) DD1.U9(GND) DD1.U11(GND) DD1.U13(GND) DD1.U17(GND) DD1.U26(GND) DD1.V4(GND) DD1.V8(GND) DD1.V9(GND) DD1.V10(GND) DD1.V12(GND) DD1.V14(GND) DD1.V16(GND) DD1.V18(GND) DD1.V23(GND) DD1.W1(GND) DD1.W2(GND) DD1.W6(GND) DD1.W9(GND) DD1.W11(GND) DD1.W13(GND) DD1.W15(GND) DD1.W17(GND) DD1.W20(GND) DD1.W30(GND) DD1.Y3(GND) DD1.Y4(GND) DD1.Y7(GND) DD1.Y8(GND) DD1.Y9(GND) DD1.Y17(GND) DD1.Y27(GND)
NetDD1_A19: DD1.A19(VCCO_17) DD1.B16(VCCO_17) DD1.D20(VCCO_17) DD1.E17(VCCO_17) DD1.G21(VCCO_17) DD1.H18(VCCO_17) DD1.L19(VCCO_17)
NetDD1_A29: DD1.A29(VCCO_16) DD1.B26(VCCO_16) DD1.C23(VCCO_16) DD1.D30(VCCO_16) DD1.E27(VCCO_16) DD1.F24(VCCO_16) DD1.H28(VCCO_16)
NetDD1_AA9: DD1.AA9(VCCO_33) DD1.AC13(VCCO_33) DD1.AD10(VCCO_33) DD1.AG11(VCCO_33) DD1.AK12(VCCO_33) DD1.Y12(VCCO_33)
NetDD1_AA19: DD1.AA19(VCCO_32) DD1.AB16(VCCO_32) DD1.AE17(VCCO_32) DD1.AF14(VCCO_32) DD1.AH18(VCCO_32) DD1.AJ15(VCCO_32)
NetDD1_AA29: DD1.AA29(VCCO_13) DD1.AB26(VCCO_13) DD1.AD30(VCCO_13) DD1.AE27(VCCO_13) DD1.AH28(VCCO_13) DD1.AJ25(VCCO_13)
NetDD1_AB6: DD1.AB6(VCCO_0) DD1.T9(VCCO_0)
NetDD1_AC3: DD1.AC3(VCCO_34) DD1.AE7(VCCO_34) DD1.AF4(VCCO_34) DD1.AG1(VCCO_34) DD1.AH8(VCCO_34) DD1.AJ5(VCCO_34) DD1.AK2(VCCO_34)
NetDD1_AC23: DD1.AC23(VCCO_12) DD1.AD20(VCCO_12) DD1.AF24(VCCO_12) DD1.AG21(VCCO_12) DD1.AK22(VCCO_12) DD1.Y22(VCCO_12)
NetDD1_B3: DD1.B3(MGTAVTT) DD1.C5(MGTAVTT) DD1.D3(MGTAVTT) DD1.E5(MGTAVTT) DD1.F3(MGTAVTT) DD1.G5(MGTAVTT) DD1.H3(MGTAVTT) DD1.J5(MGTAVTT) DD1.K3(MGTAVTT) DD1.L5(MGTAVTT) DD1.M3(MGTAVTT) DD1.N5(MGTAVTT) DD1.P3(MGTAVTT) DD1.R5(MGTAVTT) DD1.T3(MGTAVTT) DD1.U5(MGTAVTT) DD1.V3(MGTAVTT) DD1.W5(MGTAVTT)
NetDD1_B7: DD1.B7(MGTAVCC) DD1.D7(MGTAVCC) DD1.F7(MGTAVCC) DD1.H7(MGTAVCC) DD1.K7(MGTAVCC) DD1.M7(MGTAVCC) DD1.P7(MGTAVCC)
NetDD1_C13: DD1.C13(VCCO_18) DD1.D10(VCCO_18) DD1.F14(VCCO_18) DD1.G11(VCCO_18) DD1.J15(VCCO_18) DD1.K12(VCCO_18)
NetDD1_J25: DD1.J25(VCCO_15) DD1.K22(VCCO_15) DD1.L29(VCCO_15) DD1.M26(VCCO_15) DD1.N23(VCCO_15) DD1.P20(VCCO_15)
NetDD1_M11: DD1.M11(VCCINT) DD1.M13(VCCINT) DD1.M15(VCCINT) DD1.M17(VCCINT) DD1.N10(VCCINT) DD1.N12(VCCINT) DD1.N14(VCCINT) DD1.N18(VCCINT) DD1.P11(VCCINT) DD1.P17(VCCINT) DD1.R10(VCCINT) DD1.R12(VCCINT) DD1.R18(VCCINT) DD1.T11(VCCINT) DD1.T17(VCCINT) DD1.U10(VCCINT) DD1.U12(VCCINT) DD1.U18(VCCINT) DD1.V17(VCCINT) DD1.W18(VCCINT)
NetDD1_N16: DD1.N16(VCCBRAM) DD1.R16(VCCBRAM) DD1.U16(VCCBRAM) DD1.W16(VCCBRAM)
NetDD1_P13: DD1.P13(VCCAUX) DD1.T13(VCCAUX) DD1.V13(VCCAUX) DD1.V15(VCCAUX) DD1.W14(VCCAUX)
NetDD1_P30: DD1.P30(VCCO_14) DD1.R27(VCCO_14) DD1.T24(VCCO_14) DD1.U21(VCCO_14) DD1.V28(VCCO_14) DD1.W25(VCCO_14)
NetDD1_T7: DD1.T7(MGTVCCAUX) DD1.V7(MGTVCCAUX)
NetDD1_V11: DD1.V11(VCCAUX_IO_G0) DD1.W10(VCCAUX_IO_G0) DD1.W12(VCCAUX_IO_G0)

Not connected (* = marked no-connect by the designer): DD1 C10(VCCBATT_0) P15(VCCADC_0)

### Notes on the sheet
- 人
  工
  脳
- Перв. примен.
- Справ. №
- Подп. и дата
- Инв. № дубл.
- Взам. инв. №
- Инв. № подл.
- Изм.
- Лист
- № докум.
- Подп.
- Дата
- 2.106-A2
- Копировал
- Формат А2

### Library data of the parts
DD1 = XC7K325T-XFFG900: as DD1 on sheet Э3-2; Package: 900-FFG; ComponentType: IC; DatasheetURL: *; HelpURL: *; PinCount: 900; PartNumber: *

## Sheet Э3-7.SchDoc
size 594 x 420 mm; Address1: Address1; Address2: Address2; Address3: Address3; Address4: Address4; SheetNumber: 7; SheetTotal: 12; DocumentType: Схема электрическая принципиальная
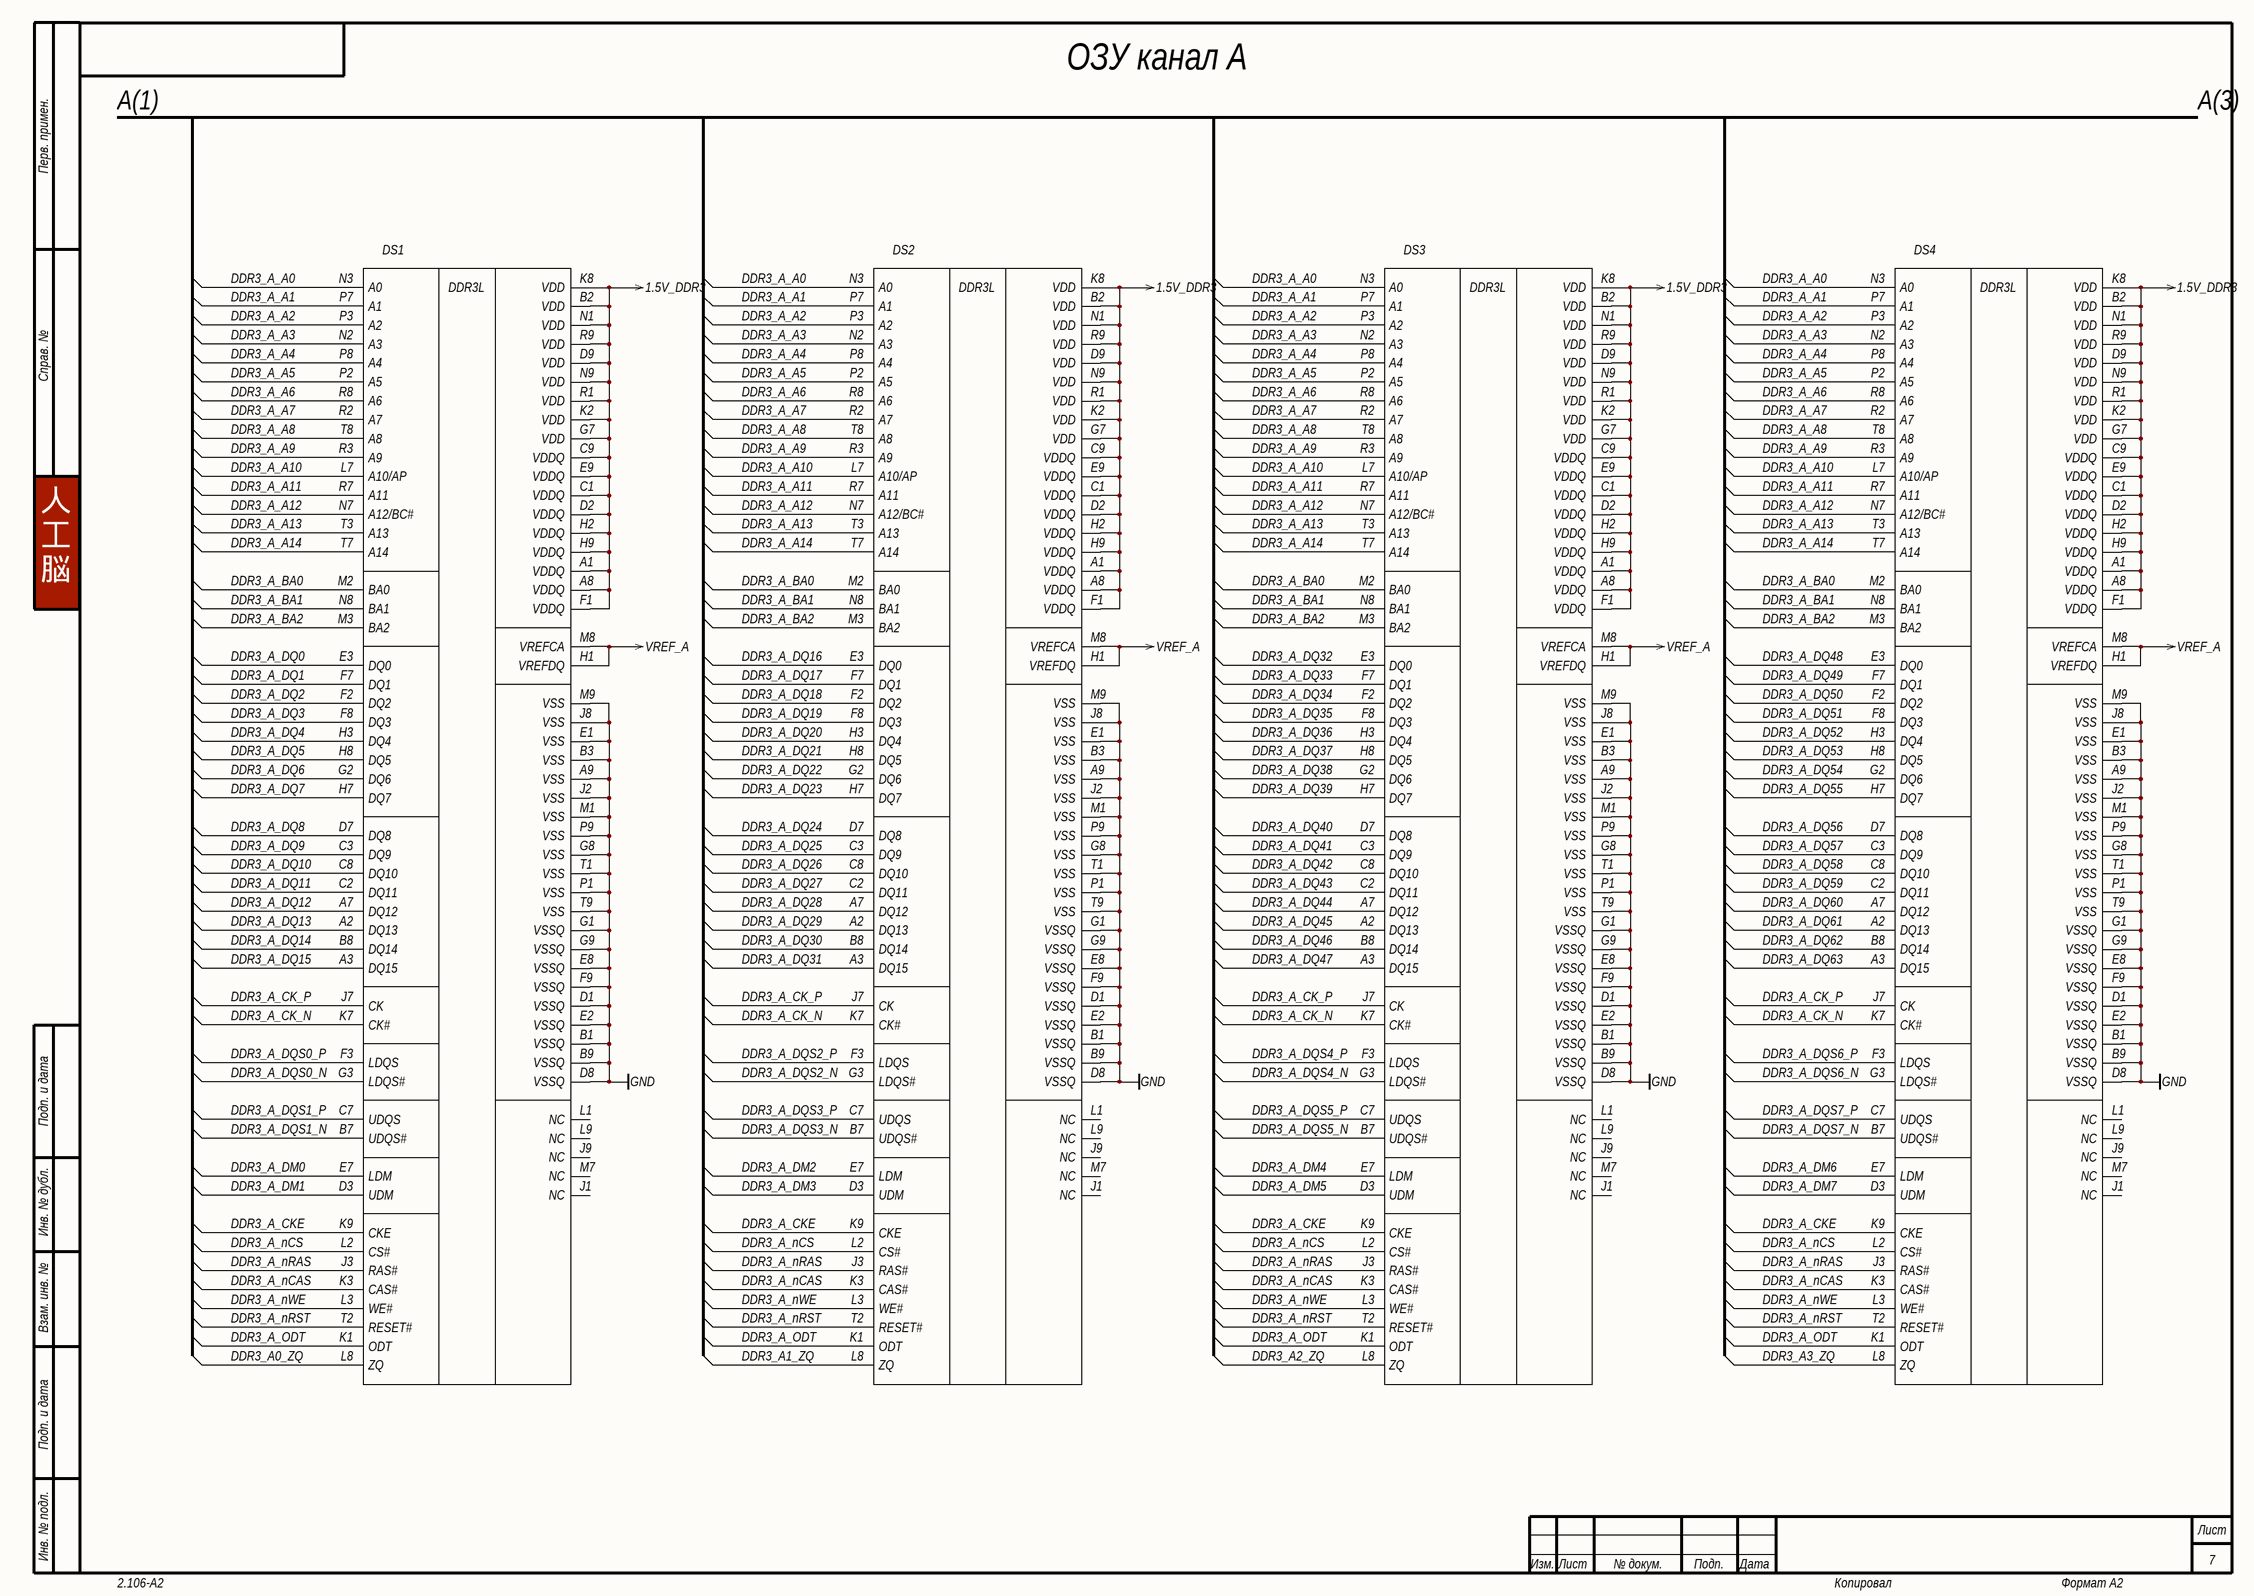
[diagram p5: Э3-7.SchDoc]

### Parts
DS1  1  [96-FBGA]  (value not drawn)
DS2  1  [96-FBGA]  (value not drawn)
DS3  1  [96-FBGA]  (value not drawn)
DS4  1  [96-FBGA]  (value not drawn)

### Nets
1.5V_DDR3: DS1.A1(VDDQ) DS1.A8(VDDQ) DS1.B2(VDD) DS1.C1(VDDQ) DS1.C9(VDDQ) DS1.D2(VDDQ) DS1.D9(VDD) DS1.E9(VDDQ) DS1.F1(VDDQ) DS1.G7(VDD) DS1.H2(VDDQ) DS1.H9(VDDQ) DS1.K2(VDD) DS1.K8(VDD) DS1.N1(VDD) DS1.N9(VDD) DS1.R1(VDD) DS1.R9(VDD) DS2.A1(VDDQ) DS2.A8(VDDQ) DS2.B2(VDD) DS2.C1(VDDQ) DS2.C9(VDDQ) DS2.D2(VDDQ) DS2.D9(VDD) DS2.E9(VDDQ) DS2.F1(VDDQ) DS2.G7(VDD) DS2.H2(VDDQ) DS2.H9(VDDQ) DS2.K2(VDD) DS2.K8(VDD) DS2.N1(VDD) DS2.N9(VDD) DS2.R1(VDD) DS2.R9(VDD) DS3.A1(VDDQ) DS3.A8(VDDQ) DS3.B2(VDD) DS3.C1(VDDQ) DS3.C9(VDDQ) DS3.D2(VDDQ) DS3.D9(VDD) DS3.E9(VDDQ) DS3.F1(VDDQ) DS3.G7(VDD) DS3.H2(VDDQ) DS3.H9(VDDQ) DS3.K2(VDD) DS3.K8(VDD) DS3.N1(VDD) DS3.N9(VDD) DS3.R1(VDD) DS3.R9(VDD) DS4.A1(VDDQ) DS4.A8(VDDQ) DS4.B2(VDD) DS4.C1(VDDQ) DS4.C9(VDDQ) DS4.D2(VDDQ) DS4.D9(VDD) DS4.E9(VDDQ) DS4.F1(VDDQ) DS4.G7(VDD) DS4.H2(VDDQ) DS4.H9(VDDQ) DS4.K2(VDD) DS4.K8(VDD) DS4.N1(VDD) DS4.N9(VDD) DS4.R1(VDD) DS4.R9(VDD)
GND: DS1.A9(VSS) DS1.B1(VSSQ) DS1.B3(VSS) DS1.B9(VSSQ) DS1.D1(VSSQ) DS1.D8(VSSQ) DS1.E1(VSS) DS1.E2(VSSQ) DS1.E8(VSSQ) DS1.F9(VSSQ) DS1.G1(VSSQ) DS1.G8(VSS) DS1.G9(VSSQ) DS1.J2(VSS) DS1.J8(VSS) DS1.M1(VSS) DS1.M9(VSS) DS1.P1(VSS) DS1.P9(VSS) DS1.T1(VSS) DS1.T9(VSS) DS2.A9(VSS) DS2.B1(VSSQ) DS2.B3(VSS) DS2.B9(VSSQ) DS2.D1(VSSQ) DS2.D8(VSSQ) DS2.E1(VSS) DS2.E2(VSSQ) DS2.E8(VSSQ) DS2.F9(VSSQ) DS2.G1(VSSQ) DS2.G8(VSS) DS2.G9(VSSQ) DS2.J2(VSS) DS2.J8(VSS) DS2.M1(VSS) DS2.M9(VSS) DS2.P1(VSS) DS2.P9(VSS) DS2.T1(VSS) DS2.T9(VSS) DS3.A9(VSS) DS3.B1(VSSQ) DS3.B3(VSS) DS3.B9(VSSQ) DS3.D1(VSSQ) DS3.D8(VSSQ) DS3.E1(VSS) DS3.E2(VSSQ) DS3.E8(VSSQ) DS3.F9(VSSQ) DS3.G1(VSSQ) DS3.G8(VSS) DS3.G9(VSSQ) DS3.J2(VSS) DS3.J8(VSS) DS3.M1(VSS) DS3.M9(VSS) DS3.P1(VSS) DS3.P9(VSS) DS3.T1(VSS) DS3.T9(VSS) DS4.A9(VSS) DS4.B1(VSSQ) DS4.B3(VSS) DS4.B9(VSSQ) DS4.D1(VSSQ) DS4.D8(VSSQ) DS4.E1(VSS) DS4.E2(VSSQ) DS4.E8(VSSQ) DS4.F9(VSSQ) DS4.G1(VSSQ) DS4.G8(VSS) DS4.G9(VSSQ) DS4.J2(VSS) DS4.J8(VSS) DS4.M1(VSS) DS4.M9(VSS) DS4.P1(VSS) DS4.P9(VSS) DS4.T1(VSS) DS4.T9(VSS)
VREF_A: DS1.H1(VREFDQ) DS1.M8(VREFCA) DS2.H1(VREFDQ) DS2.M8(VREFCA) DS3.H1(VREFDQ) DS3.M8(VREFCA) DS4.H1(VREFDQ) DS4.M8(VREFCA)
DDR3_A0_ZQ: DS1.L8(ZQ)
DDR3_A1_ZQ: DS2.L8(ZQ)
DDR3_A2_ZQ: DS3.L8(ZQ)
DDR3_A3_ZQ: DS4.L8(ZQ)
DDR3_A_A0: DS1.N3(A0) DS2.N3(A0) DS3.N3(A0) DS4.N3(A0)
DDR3_A_A1: DS1.P7(A1) DS2.P7(A1) DS3.P7(A1) DS4.P7(A1)
DDR3_A_A2: DS1.P3(A2) DS2.P3(A2) DS3.P3(A2) DS4.P3(A2)
DDR3_A_A3: DS1.N2(A3) DS2.N2(A3) DS3.N2(A3) DS4.N2(A3)
DDR3_A_A4: DS1.P8(A4) DS2.P8(A4) DS3.P8(A4) DS4.P8(A4)
DDR3_A_A5: DS1.P2(A5) DS2.P2(A5) DS3.P2(A5) DS4.P2(A5)
DDR3_A_A6: DS1.R8(A6) DS2.R8(A6) DS3.R8(A6) DS4.R8(A6)
DDR3_A_A7: DS1.R2(A7) DS2.R2(A7) DS3.R2(A7) DS4.R2(A7)
DDR3_A_A8: DS1.T8(A8) DS2.T8(A8) DS3.T8(A8) DS4.T8(A8)
DDR3_A_A9: DS1.R3(A9) DS2.R3(A9) DS3.R3(A9) DS4.R3(A9)
DDR3_A_A10: DS1.L7(A10/AP) DS2.L7(A10/AP) DS3.L7(A10/AP) DS4.L7(A10/AP)
DDR3_A_A11: DS1.R7(A11) DS2.R7(A11) DS3.R7(A11) DS4.R7(A11)
DDR3_A_A12: DS1.N7(A12/BC#) DS2.N7(A12/BC#) DS3.N7(A12/BC#) DS4.N7(A12/BC#)
DDR3_A_A13: DS1.T3(A13) DS2.T3(A13) DS3.T3(A13) DS4.T3(A13)
DDR3_A_A14: DS1.T7(A14) DS2.T7(A14) DS3.T7(A14) DS4.T7(A14)
DDR3_A_BA0: DS1.M2(BA0) DS2.M2(BA0) DS3.M2(BA0) DS4.M2(BA0)
DDR3_A_BA1: DS1.N8(BA1) DS2.N8(BA1) DS3.N8(BA1) DS4.N8(BA1)
DDR3_A_BA2: DS1.M3(BA2) DS2.M3(BA2) DS3.M3(BA2) DS4.M3(BA2)
DDR3_A_CK_N: DS1.K7(CK#) DS2.K7(CK#) DS3.K7(CK#) DS4.K7(CK#)
DDR3_A_CK_P: DS1.J7(CK) DS2.J7(CK) DS3.J7(CK) DS4.J7(CK)
DDR3_A_CKE: DS1.K9(CKE) DS2.K9(CKE) DS3.K9(CKE) DS4.K9(CKE)
DDR3_A_DM0: DS1.E7(LDM)
DDR3_A_DM1: DS1.D3(UDM)
DDR3_A_DM2: DS2.E7(LDM)
DDR3_A_DM3: DS2.D3(UDM)
DDR3_A_DM4: DS3.E7(LDM)
DDR3_A_DM5: DS3.D3(UDM)
DDR3_A_DM6: DS4.E7(LDM)
DDR3_A_DM7: DS4.D3(UDM)
DDR3_A_DQ0: DS1.E3(DQ0)
DDR3_A_DQ1: DS1.F7(DQ1)
DDR3_A_DQ2: DS1.F2(DQ2)
DDR3_A_DQ3: DS1.F8(DQ3)
DDR3_A_DQ4: DS1.H3(DQ4)
DDR3_A_DQ5: DS1.H8(DQ5)
DDR3_A_DQ6: DS1.G2(DQ6)
DDR3_A_DQ7: DS1.H7(DQ7)
DDR3_A_DQ8: DS1.D7(DQ8)
DDR3_A_DQ9: DS1.C3(DQ9)
DDR3_A_DQ10: DS1.C8(DQ10)
DDR3_A_DQ11: DS1.C2(DQ11)
DDR3_A_DQ12: DS1.A7(DQ12)
DDR3_A_DQ13: DS1.A2(DQ13)
DDR3_A_DQ14: DS1.B8(DQ14)
DDR3_A_DQ15: DS1.A3(DQ15)
DDR3_A_DQ16: DS2.E3(DQ0)
DDR3_A_DQ17: DS2.F7(DQ1)
DDR3_A_DQ18: DS2.F2(DQ2)
DDR3_A_DQ19: DS2.F8(DQ3)
DDR3_A_DQ20: DS2.H3(DQ4)
DDR3_A_DQ21: DS2.H8(DQ5)
DDR3_A_DQ22: DS2.G2(DQ6)
DDR3_A_DQ23: DS2.H7(DQ7)
DDR3_A_DQ24: DS2.D7(DQ8)
DDR3_A_DQ25: DS2.C3(DQ9)
DDR3_A_DQ26: DS2.C8(DQ10)
DDR3_A_DQ27: DS2.C2(DQ11)
DDR3_A_DQ28: DS2.A7(DQ12)
DDR3_A_DQ29: DS2.A2(DQ13)
DDR3_A_DQ30: DS2.B8(DQ14)
DDR3_A_DQ31: DS2.A3(DQ15)
DDR3_A_DQ32: DS3.E3(DQ0)
DDR3_A_DQ33: DS3.F7(DQ1)
DDR3_A_DQ34: DS3.F2(DQ2)
DDR3_A_DQ35: DS3.F8(DQ3)
DDR3_A_DQ36: DS3.H3(DQ4)
DDR3_A_DQ37: DS3.H8(DQ5)
DDR3_A_DQ38: DS3.G2(DQ6)
DDR3_A_DQ39: DS3.H7(DQ7)
DDR3_A_DQ40: DS3.D7(DQ8)
DDR3_A_DQ41: DS3.C3(DQ9)
DDR3_A_DQ42: DS3.C8(DQ10)
DDR3_A_DQ43: DS3.C2(DQ11)
DDR3_A_DQ44: DS3.A7(DQ12)
DDR3_A_DQ45: DS3.A2(DQ13)
DDR3_A_DQ46: DS3.B8(DQ14)
DDR3_A_DQ47: DS3.A3(DQ15)
DDR3_A_DQ48: DS4.E3(DQ0)
DDR3_A_DQ49: DS4.F7(DQ1)
DDR3_A_DQ50: DS4.F2(DQ2)
DDR3_A_DQ51: DS4.F8(DQ3)
DDR3_A_DQ52: DS4.H3(DQ4)
DDR3_A_DQ53: DS4.H8(DQ5)
DDR3_A_DQ54: DS4.G2(DQ6)
DDR3_A_DQ55: DS4.H7(DQ7)
DDR3_A_DQ56: DS4.D7(DQ8)
DDR3_A_DQ57: DS4.C3(DQ9)
DDR3_A_DQ58: DS4.C8(DQ10)
DDR3_A_DQ59: DS4.C2(DQ11)
DDR3_A_DQ60: DS4.A7(DQ12)
DDR3_A_DQ61: DS4.A2(DQ13)
DDR3_A_DQ62: DS4.B8(DQ14)
DDR3_A_DQ63: DS4.A3(DQ15)
DDR3_A_DQS0_N: DS1.G3(LDQS#)
DDR3_A_DQS0_P: DS1.F3(LDQS)
DDR3_A_DQS1_N: DS1.B7(UDQS#)
DDR3_A_DQS1_P: DS1.C7(UDQS)
DDR3_A_DQS2_N: DS2.G3(LDQS#)
DDR3_A_DQS2_P: DS2.F3(LDQS)
DDR3_A_DQS3_N: DS2.B7(UDQS#)
DDR3_A_DQS3_P: DS2.C7(UDQS)
DDR3_A_DQS4_N: DS3.G3(LDQS#)
DDR3_A_DQS4_P: DS3.F3(LDQS)
DDR3_A_DQS5_N: DS3.B7(UDQS#)
DDR3_A_DQS5_P: DS3.C7(UDQS)
DDR3_A_DQS6_N: DS4.G3(LDQS#)
DDR3_A_DQS6_P: DS4.F3(LDQS)
DDR3_A_DQS7_N: DS4.B7(UDQS#)
DDR3_A_DQS7_P: DS4.C7(UDQS)
DDR3_A_nCAS: DS1.K3(CAS#) DS2.K3(CAS#) DS3.K3(CAS#) DS4.K3(CAS#)
DDR3_A_nCS: DS1.L2(CS#) DS2.L2(CS#) DS3.L2(CS#) DS4.L2(CS#)
DDR3_A_nRAS: DS1.J3(RAS#) DS2.J3(RAS#) DS3.J3(RAS#) DS4.J3(RAS#)
DDR3_A_nRST: DS1.T2(RESET#) DS2.T2(RESET#) DS3.T2(RESET#) DS4.T2(RESET#)
DDR3_A_nWE: DS1.L3(WE#) DS2.L3(WE#) DS3.L3(WE#) DS4.L3(WE#)
DDR3_A_ODT: DS1.K1(ODT) DS2.K1(ODT) DS3.K1(ODT) DS4.K1(ODT)

Not connected (* = marked no-connect by the designer): DS1 J1(NC) J9(NC) L1(NC) L9(NC) M7(NC); DS2 J1(NC) J9(NC) L1(NC) L9(NC) M7(NC); DS3 J1(NC) J9(NC) L1(NC) L9(NC) M7(NC); DS4 J1(NC) J9(NC) L1(NC) L9(NC) M7(NC)

### Notes on the sheet
- A(1)
- ОЗУ канал A
- A(3)
- 人
  工
  脳
- Перв. примен.
- Справ. №
- Подп. и дата
- Инв. № дубл.
- Взам. инв. №
- Инв. № подл.
- Изм.
- Лист
- № докум.
- Подп.
- Дата
- 2.106-A2
- Копировал
- Формат А2
- (in symbol MT41K256M16TW-107IT:P) DDR3L

### Library data of the parts
DS1-DS4 = MT41K256M16TW-107IT:P: 32 Megx16x8 banks DDR3L SDRAM; Manufacturer: Micron Technology, Inc.; TemperatureRange: -...+°C; ComponentType: Микросхема; Install: 1

## Sheet Э3-8.SchDoc
size 594 x 420 mm; Address1: Address1; Address2: Address2; Address3: Address3; Address4: Address4; SheetNumber: 8; SheetTotal: 12; DocumentType: Схема электрическая принципиальная
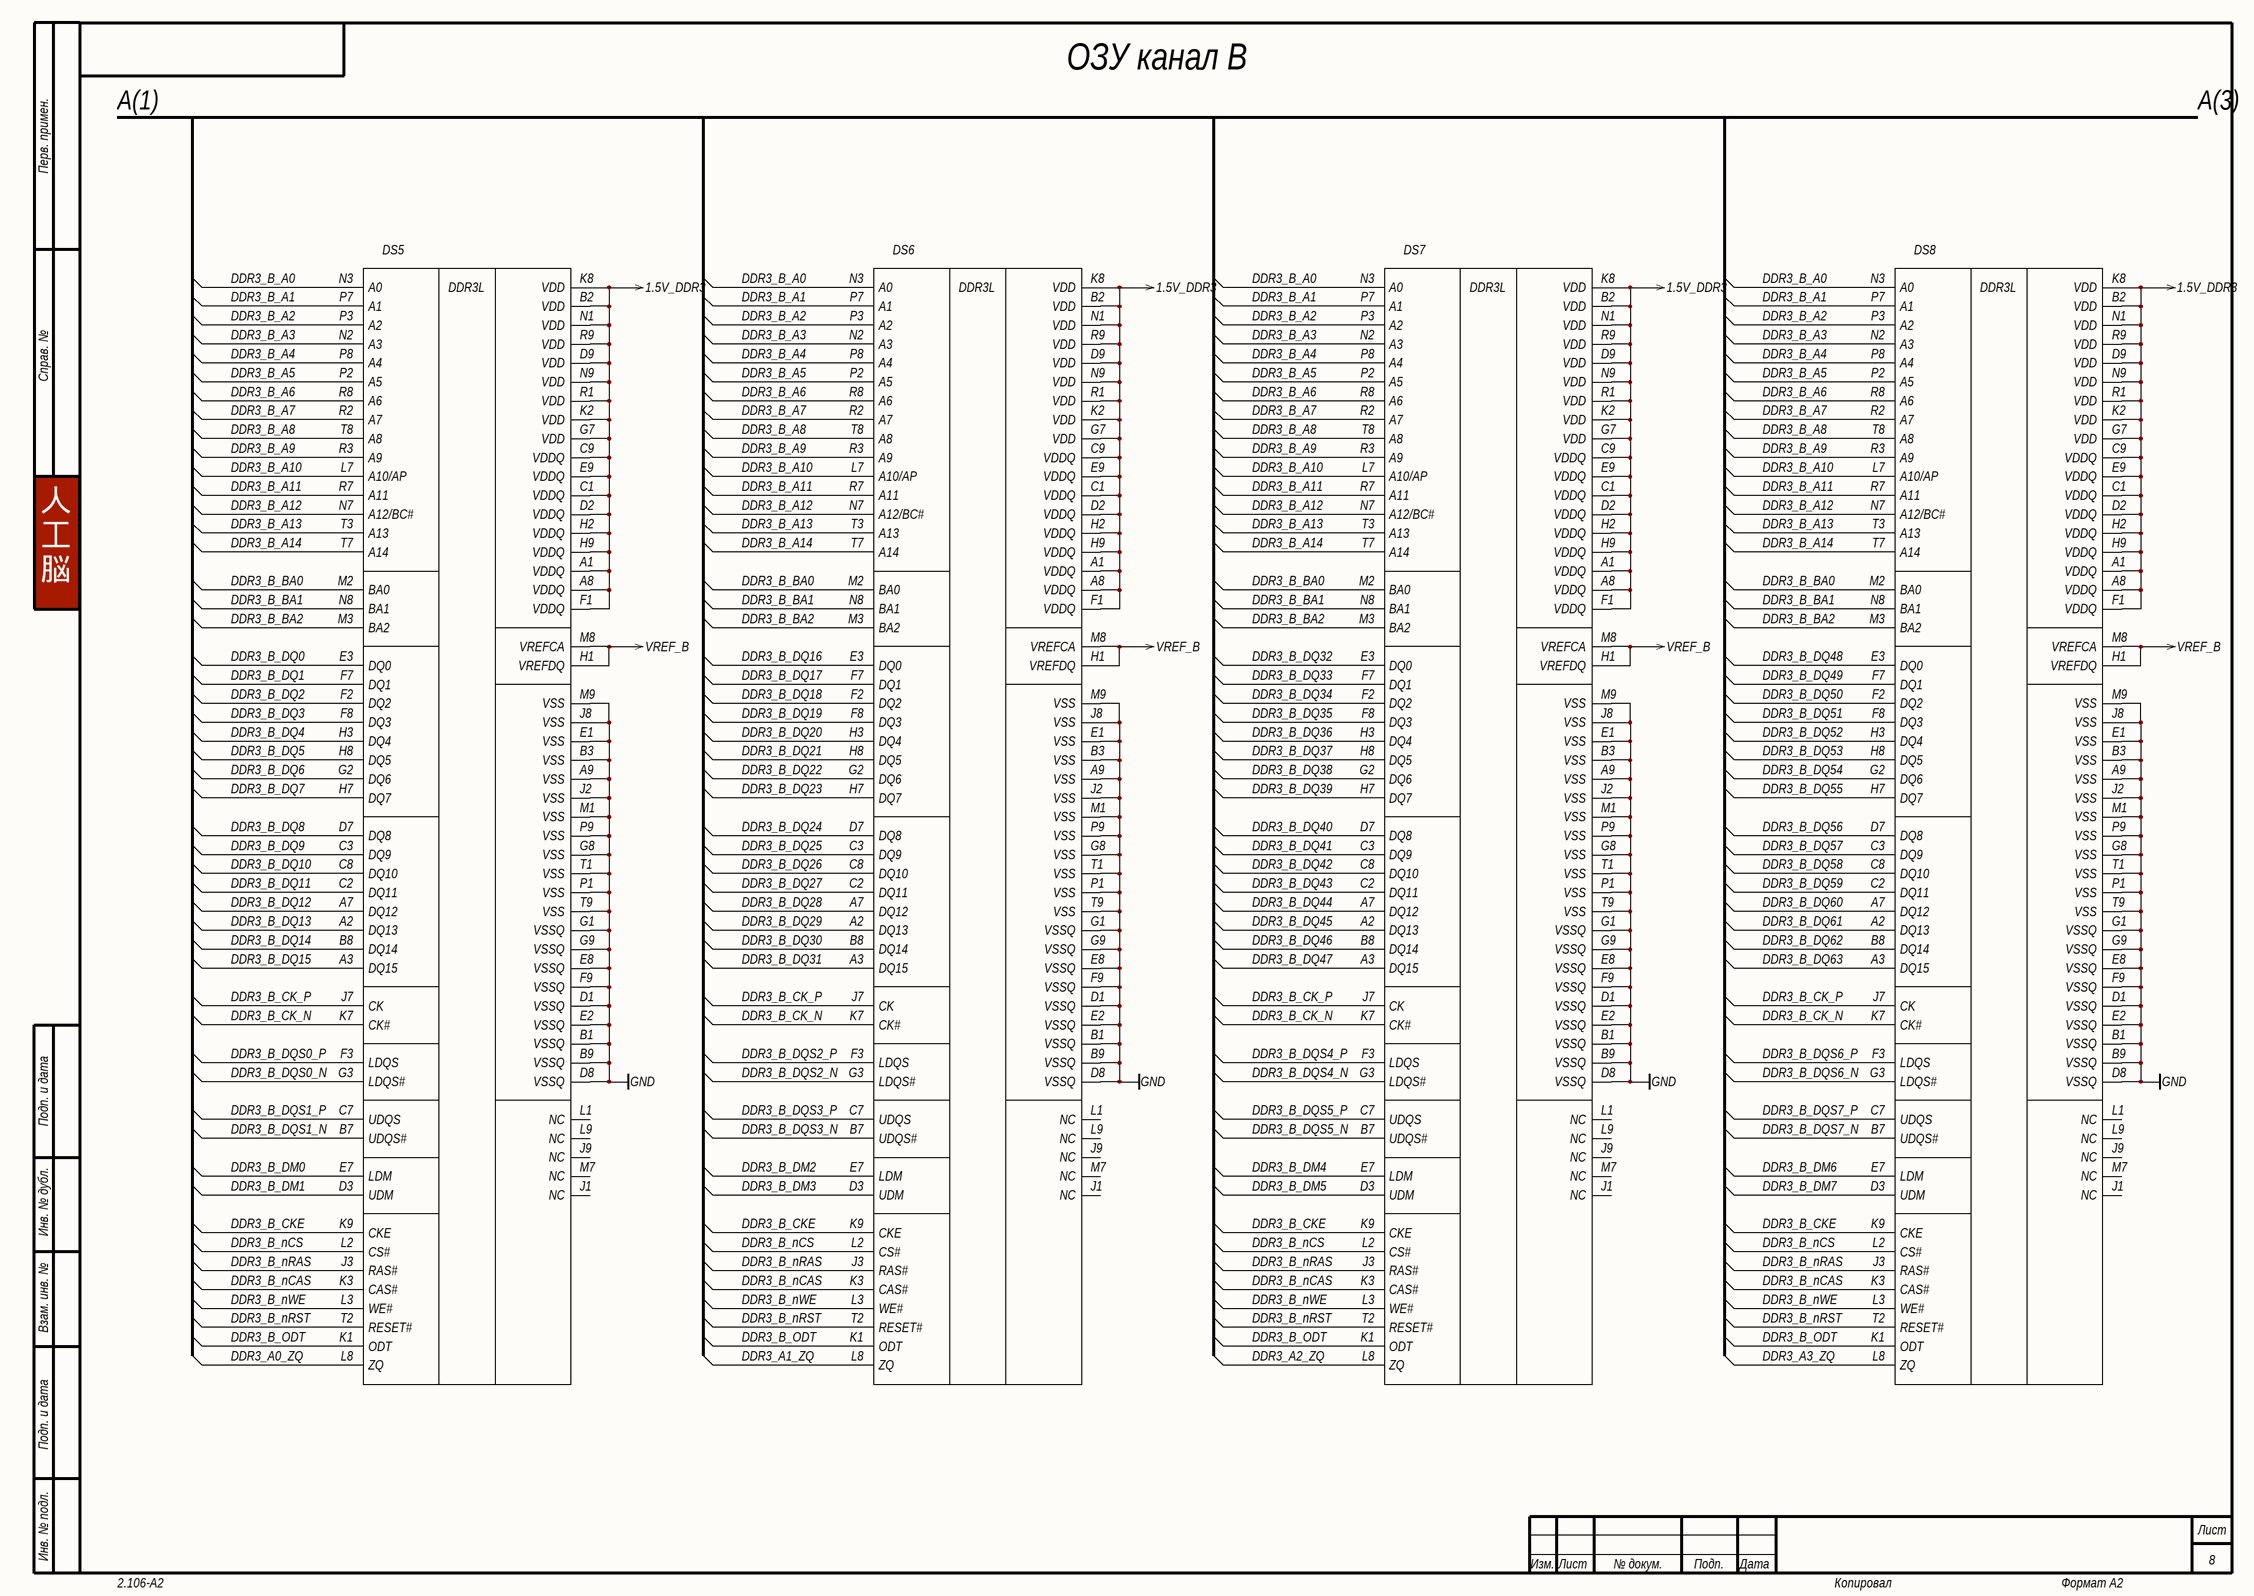
[diagram p6: Э3-8.SchDoc]

### Parts
DS5  1  [96-FBGA]  (value not drawn)
DS6  1  [96-FBGA]  (value not drawn)
DS7  1  [96-FBGA]  (value not drawn)
DS8  1  [96-FBGA]  (value not drawn)

### Nets
1.5V_DDR3: DS5.A1(VDDQ) DS5.A8(VDDQ) DS5.B2(VDD) DS5.C1(VDDQ) DS5.C9(VDDQ) DS5.D2(VDDQ) DS5.D9(VDD) DS5.E9(VDDQ) DS5.F1(VDDQ) DS5.G7(VDD) DS5.H2(VDDQ) DS5.H9(VDDQ) DS5.K2(VDD) DS5.K8(VDD) DS5.N1(VDD) DS5.N9(VDD) DS5.R1(VDD) DS5.R9(VDD) DS6.A1(VDDQ) DS6.A8(VDDQ) DS6.B2(VDD) DS6.C1(VDDQ) DS6.C9(VDDQ) DS6.D2(VDDQ) DS6.D9(VDD) DS6.E9(VDDQ) DS6.F1(VDDQ) DS6.G7(VDD) DS6.H2(VDDQ) DS6.H9(VDDQ) DS6.K2(VDD) DS6.K8(VDD) DS6.N1(VDD) DS6.N9(VDD) DS6.R1(VDD) DS6.R9(VDD) DS7.A1(VDDQ) DS7.A8(VDDQ) DS7.B2(VDD) DS7.C1(VDDQ) DS7.C9(VDDQ) DS7.D2(VDDQ) DS7.D9(VDD) DS7.E9(VDDQ) DS7.F1(VDDQ) DS7.G7(VDD) DS7.H2(VDDQ) DS7.H9(VDDQ) DS7.K2(VDD) DS7.K8(VDD) DS7.N1(VDD) DS7.N9(VDD) DS7.R1(VDD) DS7.R9(VDD) DS8.A1(VDDQ) DS8.A8(VDDQ) DS8.B2(VDD) DS8.C1(VDDQ) DS8.C9(VDDQ) DS8.D2(VDDQ) DS8.D9(VDD) DS8.E9(VDDQ) DS8.F1(VDDQ) DS8.G7(VDD) DS8.H2(VDDQ) DS8.H9(VDDQ) DS8.K2(VDD) DS8.K8(VDD) DS8.N1(VDD) DS8.N9(VDD) DS8.R1(VDD) DS8.R9(VDD)
GND: DS5.A9(VSS) DS5.B1(VSSQ) DS5.B3(VSS) DS5.B9(VSSQ) DS5.D1(VSSQ) DS5.D8(VSSQ) DS5.E1(VSS) DS5.E2(VSSQ) DS5.E8(VSSQ) DS5.F9(VSSQ) DS5.G1(VSSQ) DS5.G8(VSS) DS5.G9(VSSQ) DS5.J2(VSS) DS5.J8(VSS) DS5.M1(VSS) DS5.M9(VSS) DS5.P1(VSS) DS5.P9(VSS) DS5.T1(VSS) DS5.T9(VSS) DS6.A9(VSS) DS6.B1(VSSQ) DS6.B3(VSS) DS6.B9(VSSQ) DS6.D1(VSSQ) DS6.D8(VSSQ) DS6.E1(VSS) DS6.E2(VSSQ) DS6.E8(VSSQ) DS6.F9(VSSQ) DS6.G1(VSSQ) DS6.G8(VSS) DS6.G9(VSSQ) DS6.J2(VSS) DS6.J8(VSS) DS6.M1(VSS) DS6.M9(VSS) DS6.P1(VSS) DS6.P9(VSS) DS6.T1(VSS) DS6.T9(VSS) DS7.A9(VSS) DS7.B1(VSSQ) DS7.B3(VSS) DS7.B9(VSSQ) DS7.D1(VSSQ) DS7.D8(VSSQ) DS7.E1(VSS) DS7.E2(VSSQ) DS7.E8(VSSQ) DS7.F9(VSSQ) DS7.G1(VSSQ) DS7.G8(VSS) DS7.G9(VSSQ) DS7.J2(VSS) DS7.J8(VSS) DS7.M1(VSS) DS7.M9(VSS) DS7.P1(VSS) DS7.P9(VSS) DS7.T1(VSS) DS7.T9(VSS) DS8.A9(VSS) DS8.B1(VSSQ) DS8.B3(VSS) DS8.B9(VSSQ) DS8.D1(VSSQ) DS8.D8(VSSQ) DS8.E1(VSS) DS8.E2(VSSQ) DS8.E8(VSSQ) DS8.F9(VSSQ) DS8.G1(VSSQ) DS8.G8(VSS) DS8.G9(VSSQ) DS8.J2(VSS) DS8.J8(VSS) DS8.M1(VSS) DS8.M9(VSS) DS8.P1(VSS) DS8.P9(VSS) DS8.T1(VSS) DS8.T9(VSS)
VREF_B: DS5.H1(VREFDQ) DS5.M8(VREFCA) DS6.H1(VREFDQ) DS6.M8(VREFCA) DS7.H1(VREFDQ) DS7.M8(VREFCA) DS8.H1(VREFDQ) DS8.M8(VREFCA)
DDR3_A0_ZQ: DS5.L8(ZQ)
DDR3_A1_ZQ: DS6.L8(ZQ)
DDR3_A2_ZQ: DS7.L8(ZQ)
DDR3_A3_ZQ: DS8.L8(ZQ)
DDR3_B_A0: DS5.N3(A0) DS6.N3(A0) DS7.N3(A0) DS8.N3(A0)
DDR3_B_A1: DS5.P7(A1) DS6.P7(A1) DS7.P7(A1) DS8.P7(A1)
DDR3_B_A2: DS5.P3(A2) DS6.P3(A2) DS7.P3(A2) DS8.P3(A2)
DDR3_B_A3: DS5.N2(A3) DS6.N2(A3) DS7.N2(A3) DS8.N2(A3)
DDR3_B_A4: DS5.P8(A4) DS6.P8(A4) DS7.P8(A4) DS8.P8(A4)
DDR3_B_A5: DS5.P2(A5) DS6.P2(A5) DS7.P2(A5) DS8.P2(A5)
DDR3_B_A6: DS5.R8(A6) DS6.R8(A6) DS7.R8(A6) DS8.R8(A6)
DDR3_B_A7: DS5.R2(A7) DS6.R2(A7) DS7.R2(A7) DS8.R2(A7)
DDR3_B_A8: DS5.T8(A8) DS6.T8(A8) DS7.T8(A8) DS8.T8(A8)
DDR3_B_A9: DS5.R3(A9) DS6.R3(A9) DS7.R3(A9) DS8.R3(A9)
DDR3_B_A10: DS5.L7(A10/AP) DS6.L7(A10/AP) DS7.L7(A10/AP) DS8.L7(A10/AP)
DDR3_B_A11: DS5.R7(A11) DS6.R7(A11) DS7.R7(A11) DS8.R7(A11)
DDR3_B_A12: DS5.N7(A12/BC#) DS6.N7(A12/BC#) DS7.N7(A12/BC#) DS8.N7(A12/BC#)
DDR3_B_A13: DS5.T3(A13) DS6.T3(A13) DS7.T3(A13) DS8.T3(A13)
DDR3_B_A14: DS5.T7(A14) DS6.T7(A14) DS7.T7(A14) DS8.T7(A14)
DDR3_B_BA0: DS5.M2(BA0) DS6.M2(BA0) DS7.M2(BA0) DS8.M2(BA0)
DDR3_B_BA1: DS5.N8(BA1) DS6.N8(BA1) DS7.N8(BA1) DS8.N8(BA1)
DDR3_B_BA2: DS5.M3(BA2) DS6.M3(BA2) DS7.M3(BA2) DS8.M3(BA2)
DDR3_B_CK_N: DS5.K7(CK#) DS6.K7(CK#) DS7.K7(CK#) DS8.K7(CK#)
DDR3_B_CK_P: DS5.J7(CK) DS6.J7(CK) DS7.J7(CK) DS8.J7(CK)
DDR3_B_CKE: DS5.K9(CKE) DS6.K9(CKE) DS7.K9(CKE) DS8.K9(CKE)
DDR3_B_DM0: DS5.E7(LDM)
DDR3_B_DM1: DS5.D3(UDM)
DDR3_B_DM2: DS6.E7(LDM)
DDR3_B_DM3: DS6.D3(UDM)
DDR3_B_DM4: DS7.E7(LDM)
DDR3_B_DM5: DS7.D3(UDM)
DDR3_B_DM6: DS8.E7(LDM)
DDR3_B_DM7: DS8.D3(UDM)
DDR3_B_DQ0: DS5.E3(DQ0)
DDR3_B_DQ1: DS5.F7(DQ1)
DDR3_B_DQ2: DS5.F2(DQ2)
DDR3_B_DQ3: DS5.F8(DQ3)
DDR3_B_DQ4: DS5.H3(DQ4)
DDR3_B_DQ5: DS5.H8(DQ5)
DDR3_B_DQ6: DS5.G2(DQ6)
DDR3_B_DQ7: DS5.H7(DQ7)
DDR3_B_DQ8: DS5.D7(DQ8)
DDR3_B_DQ9: DS5.C3(DQ9)
DDR3_B_DQ10: DS5.C8(DQ10)
DDR3_B_DQ11: DS5.C2(DQ11)
DDR3_B_DQ12: DS5.A7(DQ12)
DDR3_B_DQ13: DS5.A2(DQ13)
DDR3_B_DQ14: DS5.B8(DQ14)
DDR3_B_DQ15: DS5.A3(DQ15)
DDR3_B_DQ16: DS6.E3(DQ0)
DDR3_B_DQ17: DS6.F7(DQ1)
DDR3_B_DQ18: DS6.F2(DQ2)
DDR3_B_DQ19: DS6.F8(DQ3)
DDR3_B_DQ20: DS6.H3(DQ4)
DDR3_B_DQ21: DS6.H8(DQ5)
DDR3_B_DQ22: DS6.G2(DQ6)
DDR3_B_DQ23: DS6.H7(DQ7)
DDR3_B_DQ24: DS6.D7(DQ8)
DDR3_B_DQ25: DS6.C3(DQ9)
DDR3_B_DQ26: DS6.C8(DQ10)
DDR3_B_DQ27: DS6.C2(DQ11)
DDR3_B_DQ28: DS6.A7(DQ12)
DDR3_B_DQ29: DS6.A2(DQ13)
DDR3_B_DQ30: DS6.B8(DQ14)
DDR3_B_DQ31: DS6.A3(DQ15)
DDR3_B_DQ32: DS7.E3(DQ0)
DDR3_B_DQ33: DS7.F7(DQ1)
DDR3_B_DQ34: DS7.F2(DQ2)
DDR3_B_DQ35: DS7.F8(DQ3)
DDR3_B_DQ36: DS7.H3(DQ4)
DDR3_B_DQ37: DS7.H8(DQ5)
DDR3_B_DQ38: DS7.G2(DQ6)
DDR3_B_DQ39: DS7.H7(DQ7)
DDR3_B_DQ40: DS7.D7(DQ8)
DDR3_B_DQ41: DS7.C3(DQ9)
DDR3_B_DQ42: DS7.C8(DQ10)
DDR3_B_DQ43: DS7.C2(DQ11)
DDR3_B_DQ44: DS7.A7(DQ12)
DDR3_B_DQ45: DS7.A2(DQ13)
DDR3_B_DQ46: DS7.B8(DQ14)
DDR3_B_DQ47: DS7.A3(DQ15)
DDR3_B_DQ48: DS8.E3(DQ0)
DDR3_B_DQ49: DS8.F7(DQ1)
DDR3_B_DQ50: DS8.F2(DQ2)
DDR3_B_DQ51: DS8.F8(DQ3)
DDR3_B_DQ52: DS8.H3(DQ4)
DDR3_B_DQ53: DS8.H8(DQ5)
DDR3_B_DQ54: DS8.G2(DQ6)
DDR3_B_DQ55: DS8.H7(DQ7)
DDR3_B_DQ56: DS8.D7(DQ8)
DDR3_B_DQ57: DS8.C3(DQ9)
DDR3_B_DQ58: DS8.C8(DQ10)
DDR3_B_DQ59: DS8.C2(DQ11)
DDR3_B_DQ60: DS8.A7(DQ12)
DDR3_B_DQ61: DS8.A2(DQ13)
DDR3_B_DQ62: DS8.B8(DQ14)
DDR3_B_DQ63: DS8.A3(DQ15)
DDR3_B_DQS0_N: DS5.G3(LDQS#)
DDR3_B_DQS0_P: DS5.F3(LDQS)
DDR3_B_DQS1_N: DS5.B7(UDQS#)
DDR3_B_DQS1_P: DS5.C7(UDQS)
DDR3_B_DQS2_N: DS6.G3(LDQS#)
DDR3_B_DQS2_P: DS6.F3(LDQS)
DDR3_B_DQS3_N: DS6.B7(UDQS#)
DDR3_B_DQS3_P: DS6.C7(UDQS)
DDR3_B_DQS4_N: DS7.G3(LDQS#)
DDR3_B_DQS4_P: DS7.F3(LDQS)
DDR3_B_DQS5_N: DS7.B7(UDQS#)
DDR3_B_DQS5_P: DS7.C7(UDQS)
DDR3_B_DQS6_N: DS8.G3(LDQS#)
DDR3_B_DQS6_P: DS8.F3(LDQS)
DDR3_B_DQS7_N: DS8.B7(UDQS#)
DDR3_B_DQS7_P: DS8.C7(UDQS)
DDR3_B_nCAS: DS5.K3(CAS#) DS6.K3(CAS#) DS7.K3(CAS#) DS8.K3(CAS#)
DDR3_B_nCS: DS5.L2(CS#) DS6.L2(CS#) DS7.L2(CS#) DS8.L2(CS#)
DDR3_B_nRAS: DS5.J3(RAS#) DS6.J3(RAS#) DS7.J3(RAS#) DS8.J3(RAS#)
DDR3_B_nRST: DS5.T2(RESET#) DS6.T2(RESET#) DS7.T2(RESET#) DS8.T2(RESET#)
DDR3_B_nWE: DS5.L3(WE#) DS6.L3(WE#) DS7.L3(WE#) DS8.L3(WE#)
DDR3_B_ODT: DS5.K1(ODT) DS6.K1(ODT) DS7.K1(ODT) DS8.K1(ODT)

Not connected (* = marked no-connect by the designer): DS5 J1(NC) J9(NC) L1(NC) L9(NC) M7(NC); DS6 J1(NC) J9(NC) L1(NC) L9(NC) M7(NC); DS7 J1(NC) J9(NC) L1(NC) L9(NC) M7(NC); DS8 J1(NC) J9(NC) L1(NC) L9(NC) M7(NC)

### Notes on the sheet
- A(1)
- ОЗУ канал B
- A(3)
- 人
  工
  脳
- Перв. примен.
- Справ. №
- Подп. и дата
- Инв. № дубл.
- Взам. инв. №
- Инв. № подл.
- Изм.
- Лист
- № докум.
- Подп.
- Дата
- 2.106-A2
- Копировал
- Формат А2
- (in symbol MT41K256M16TW-107IT:P) DDR3L

### Library data of the parts
DS5-DS8 = MT41K256M16TW-107IT:P: as DS1 on sheet Э3-7; ComponentType: Микросхема; Install: 1

## Sheet Э3-9.SchDoc
size 594 x 420 mm; Address1: Address1; Address2: Address2; Address3: Address3; Address4: Address4; SheetNumber: 9; SheetTotal: 12; DocumentType: Схема электрическая принципиальная
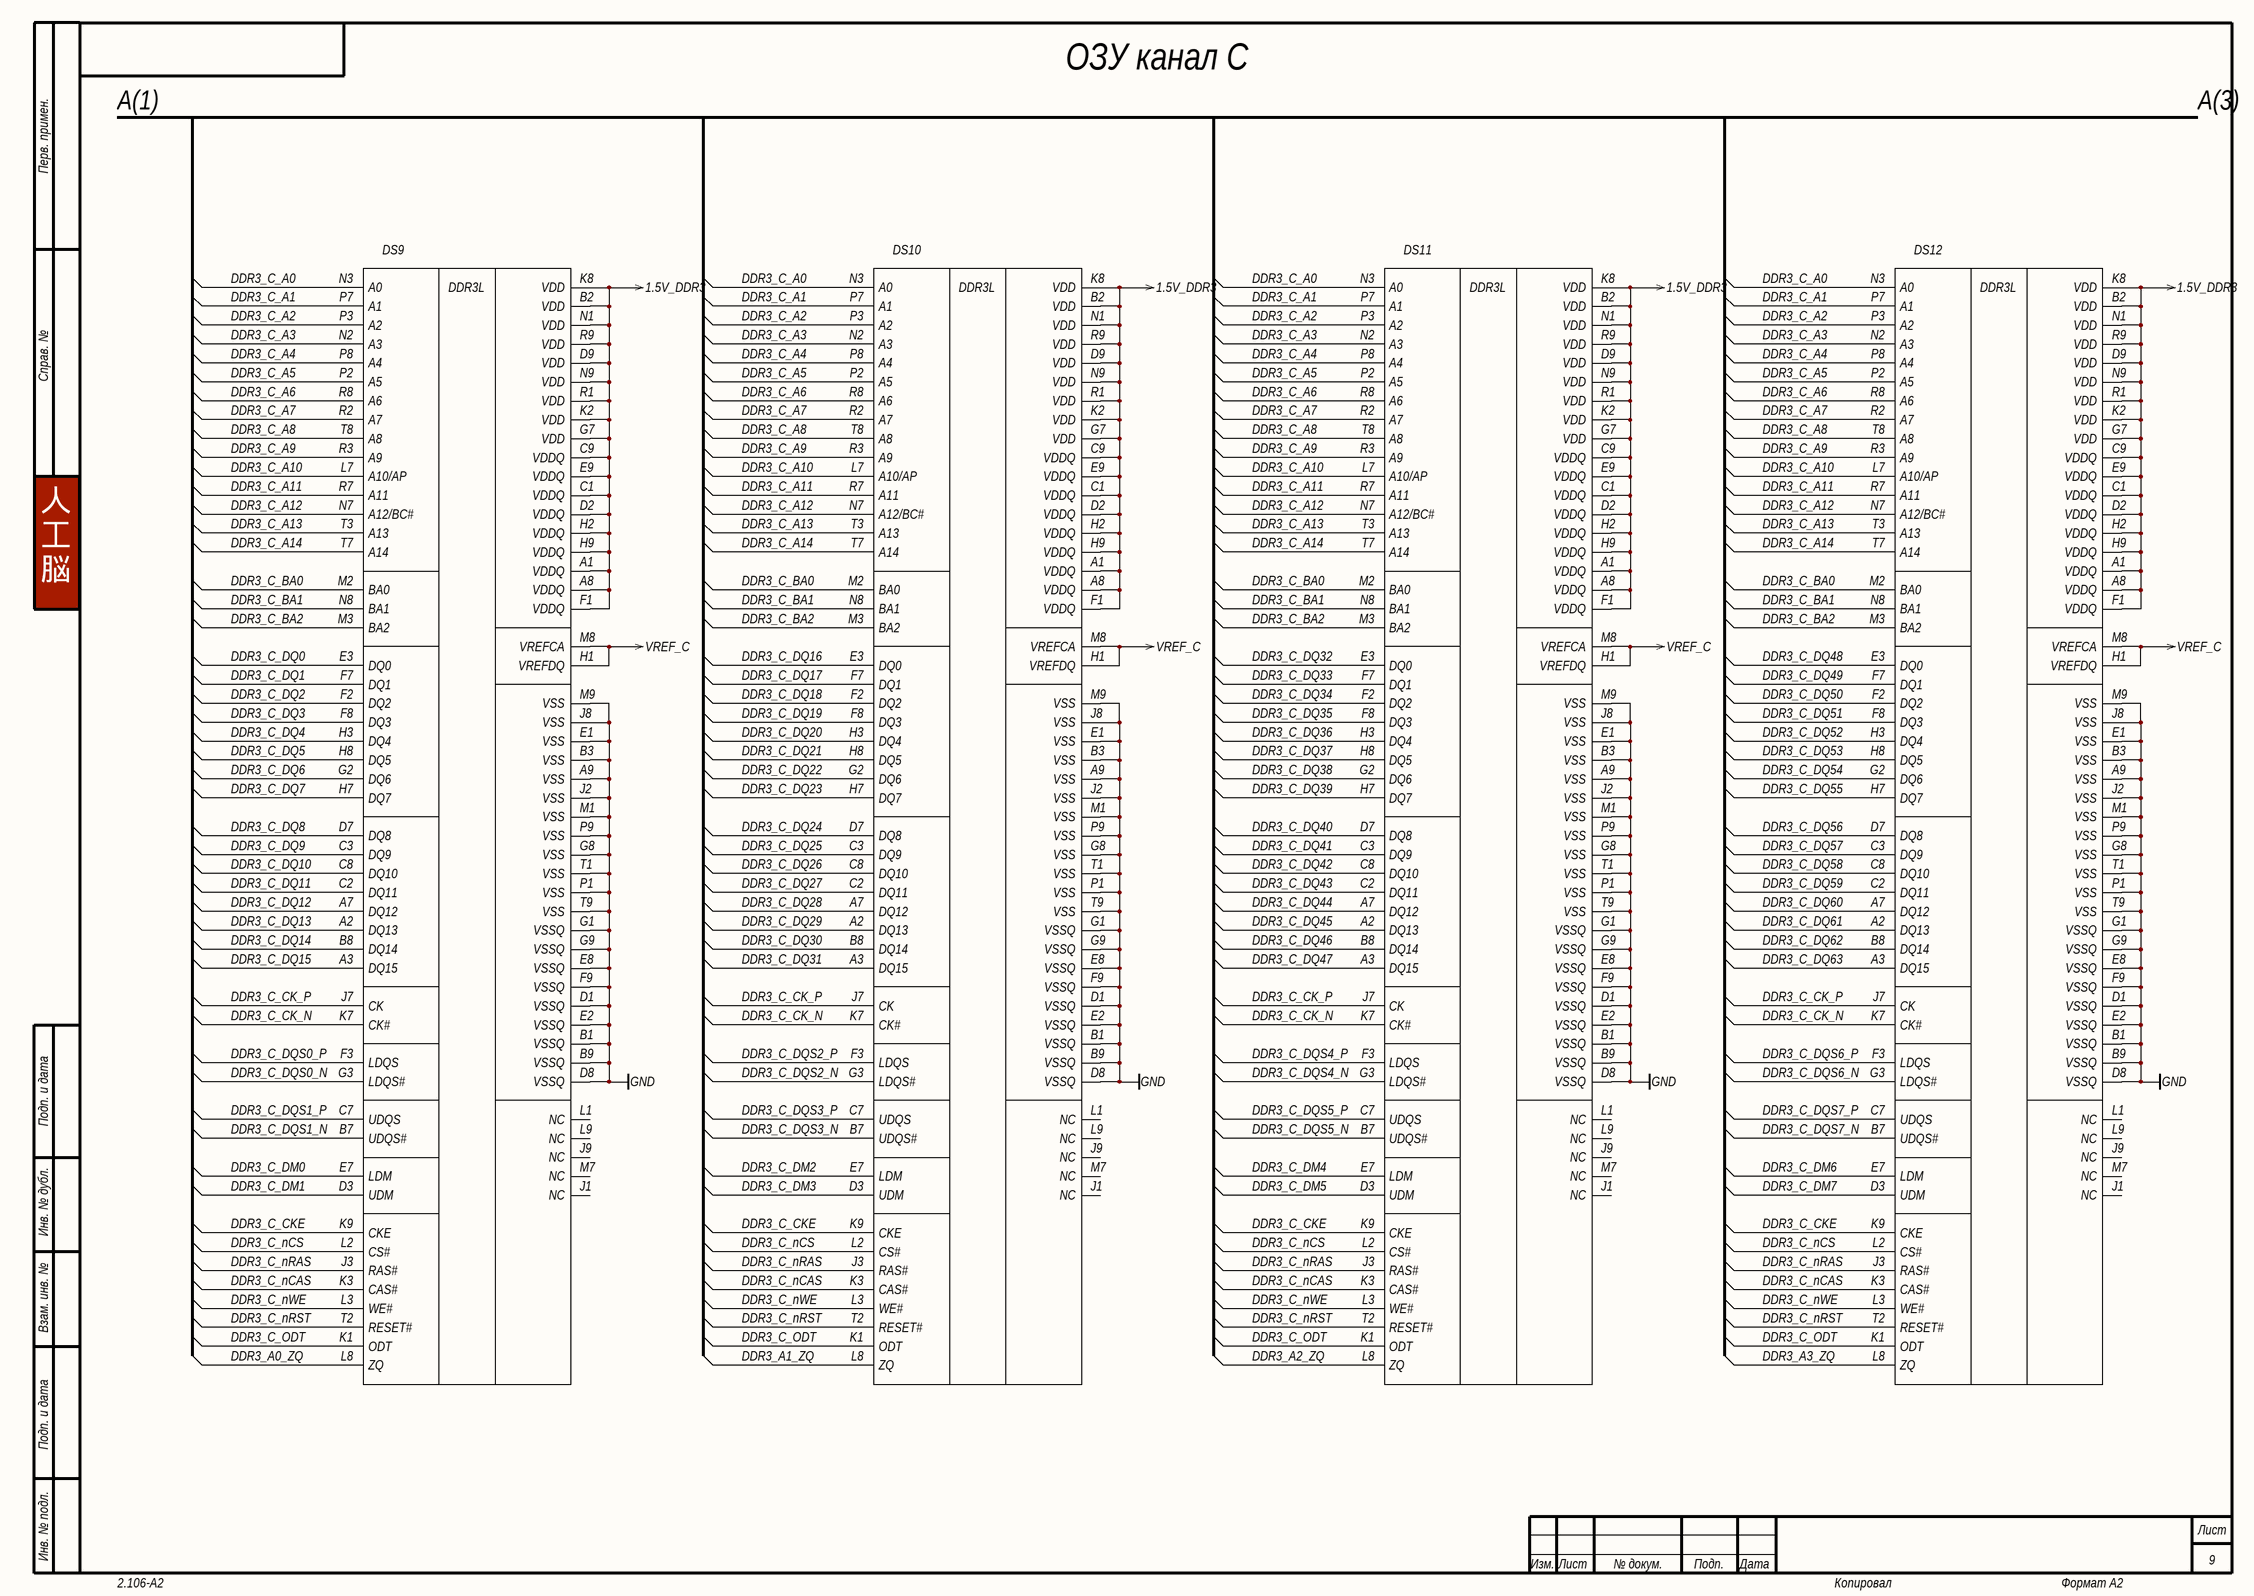
[diagram p7: Э3-9.SchDoc]

### Parts
DS9  1  [96-FBGA]  (value not drawn)
DS10  1  [96-FBGA]  (value not drawn)
DS11  1  [96-FBGA]  (value not drawn)
DS12  1  [96-FBGA]  (value not drawn)

### Nets
1.5V_DDR3: DS9.A1(VDDQ) DS9.A8(VDDQ) DS9.B2(VDD) DS9.C1(VDDQ) DS9.C9(VDDQ) DS9.D2(VDDQ) DS9.D9(VDD) DS9.E9(VDDQ) DS9.F1(VDDQ) DS9.G7(VDD) DS9.H2(VDDQ) DS9.H9(VDDQ) DS9.K2(VDD) DS9.K8(VDD) DS9.N1(VDD) DS9.N9(VDD) DS9.R1(VDD) DS9.R9(VDD) DS10.A1(VDDQ) DS10.A8(VDDQ) DS10.B2(VDD) DS10.C1(VDDQ) DS10.C9(VDDQ) DS10.D2(VDDQ) DS10.D9(VDD) DS10.E9(VDDQ) DS10.F1(VDDQ) DS10.G7(VDD) DS10.H2(VDDQ) DS10.H9(VDDQ) DS10.K2(VDD) DS10.K8(VDD) DS10.N1(VDD) DS10.N9(VDD) DS10.R1(VDD) DS10.R9(VDD) DS11.A1(VDDQ) DS11.A8(VDDQ) DS11.B2(VDD) DS11.C1(VDDQ) DS11.C9(VDDQ) DS11.D2(VDDQ) DS11.D9(VDD) DS11.E9(VDDQ) DS11.F1(VDDQ) DS11.G7(VDD) DS11.H2(VDDQ) DS11.H9(VDDQ) DS11.K2(VDD) DS11.K8(VDD) DS11.N1(VDD) DS11.N9(VDD) DS11.R1(VDD) DS11.R9(VDD) DS12.A1(VDDQ) DS12.A8(VDDQ) DS12.B2(VDD) DS12.C1(VDDQ) DS12.C9(VDDQ) DS12.D2(VDDQ) DS12.D9(VDD) DS12.E9(VDDQ) DS12.F1(VDDQ) DS12.G7(VDD) DS12.H2(VDDQ) DS12.H9(VDDQ) DS12.K2(VDD) DS12.K8(VDD) DS12.N1(VDD) DS12.N9(VDD) DS12.R1(VDD) DS12.R9(VDD)
GND: DS9.A9(VSS) DS9.B1(VSSQ) DS9.B3(VSS) DS9.B9(VSSQ) DS9.D1(VSSQ) DS9.D8(VSSQ) DS9.E1(VSS) DS9.E2(VSSQ) DS9.E8(VSSQ) DS9.F9(VSSQ) DS9.G1(VSSQ) DS9.G8(VSS) DS9.G9(VSSQ) DS9.J2(VSS) DS9.J8(VSS) DS9.M1(VSS) DS9.M9(VSS) DS9.P1(VSS) DS9.P9(VSS) DS9.T1(VSS) DS9.T9(VSS) DS10.A9(VSS) DS10.B1(VSSQ) DS10.B3(VSS) DS10.B9(VSSQ) DS10.D1(VSSQ) DS10.D8(VSSQ) DS10.E1(VSS) DS10.E2(VSSQ) DS10.E8(VSSQ) DS10.F9(VSSQ) DS10.G1(VSSQ) DS10.G8(VSS) DS10.G9(VSSQ) DS10.J2(VSS) DS10.J8(VSS) DS10.M1(VSS) DS10.M9(VSS) DS10.P1(VSS) DS10.P9(VSS) DS10.T1(VSS) DS10.T9(VSS) DS11.A9(VSS) DS11.B1(VSSQ) DS11.B3(VSS) DS11.B9(VSSQ) DS11.D1(VSSQ) DS11.D8(VSSQ) DS11.E1(VSS) DS11.E2(VSSQ) DS11.E8(VSSQ) DS11.F9(VSSQ) DS11.G1(VSSQ) DS11.G8(VSS) DS11.G9(VSSQ) DS11.J2(VSS) DS11.J8(VSS) DS11.M1(VSS) DS11.M9(VSS) DS11.P1(VSS) DS11.P9(VSS) DS11.T1(VSS) DS11.T9(VSS) DS12.A9(VSS) DS12.B1(VSSQ) DS12.B3(VSS) DS12.B9(VSSQ) DS12.D1(VSSQ) DS12.D8(VSSQ) DS12.E1(VSS) DS12.E2(VSSQ) DS12.E8(VSSQ) DS12.F9(VSSQ) DS12.G1(VSSQ) DS12.G8(VSS) DS12.G9(VSSQ) DS12.J2(VSS) DS12.J8(VSS) DS12.M1(VSS) DS12.M9(VSS) DS12.P1(VSS) DS12.P9(VSS) DS12.T1(VSS) DS12.T9(VSS)
VREF_C: DS9.H1(VREFDQ) DS9.M8(VREFCA) DS10.H1(VREFDQ) DS10.M8(VREFCA) DS11.H1(VREFDQ) DS11.M8(VREFCA) DS12.H1(VREFDQ) DS12.M8(VREFCA)
DDR3_A0_ZQ: DS9.L8(ZQ)
DDR3_A1_ZQ: DS10.L8(ZQ)
DDR3_A2_ZQ: DS11.L8(ZQ)
DDR3_A3_ZQ: DS12.L8(ZQ)
DDR3_C_A0: DS9.N3(A0) DS10.N3(A0) DS11.N3(A0) DS12.N3(A0)
DDR3_C_A1: DS9.P7(A1) DS10.P7(A1) DS11.P7(A1) DS12.P7(A1)
DDR3_C_A2: DS9.P3(A2) DS10.P3(A2) DS11.P3(A2) DS12.P3(A2)
DDR3_C_A3: DS9.N2(A3) DS10.N2(A3) DS11.N2(A3) DS12.N2(A3)
DDR3_C_A4: DS9.P8(A4) DS10.P8(A4) DS11.P8(A4) DS12.P8(A4)
DDR3_C_A5: DS9.P2(A5) DS10.P2(A5) DS11.P2(A5) DS12.P2(A5)
DDR3_C_A6: DS9.R8(A6) DS10.R8(A6) DS11.R8(A6) DS12.R8(A6)
DDR3_C_A7: DS9.R2(A7) DS10.R2(A7) DS11.R2(A7) DS12.R2(A7)
DDR3_C_A8: DS9.T8(A8) DS10.T8(A8) DS11.T8(A8) DS12.T8(A8)
DDR3_C_A9: DS9.R3(A9) DS10.R3(A9) DS11.R3(A9) DS12.R3(A9)
DDR3_C_A10: DS9.L7(A10/AP) DS10.L7(A10/AP) DS11.L7(A10/AP) DS12.L7(A10/AP)
DDR3_C_A11: DS9.R7(A11) DS10.R7(A11) DS11.R7(A11) DS12.R7(A11)
DDR3_C_A12: DS9.N7(A12/BC#) DS10.N7(A12/BC#) DS11.N7(A12/BC#) DS12.N7(A12/BC#)
DDR3_C_A13: DS9.T3(A13) DS10.T3(A13) DS11.T3(A13) DS12.T3(A13)
DDR3_C_A14: DS9.T7(A14) DS10.T7(A14) DS11.T7(A14) DS12.T7(A14)
DDR3_C_BA0: DS9.M2(BA0) DS10.M2(BA0) DS11.M2(BA0) DS12.M2(BA0)
DDR3_C_BA1: DS9.N8(BA1) DS10.N8(BA1) DS11.N8(BA1) DS12.N8(BA1)
DDR3_C_BA2: DS9.M3(BA2) DS10.M3(BA2) DS11.M3(BA2) DS12.M3(BA2)
DDR3_C_CK_N: DS9.K7(CK#) DS10.K7(CK#) DS11.K7(CK#) DS12.K7(CK#)
DDR3_C_CK_P: DS9.J7(CK) DS10.J7(CK) DS11.J7(CK) DS12.J7(CK)
DDR3_C_CKE: DS9.K9(CKE) DS10.K9(CKE) DS11.K9(CKE) DS12.K9(CKE)
DDR3_C_DM0: DS9.E7(LDM)
DDR3_C_DM1: DS9.D3(UDM)
DDR3_C_DM2: DS10.E7(LDM)
DDR3_C_DM3: DS10.D3(UDM)
DDR3_C_DM4: DS11.E7(LDM)
DDR3_C_DM5: DS11.D3(UDM)
DDR3_C_DM6: DS12.E7(LDM)
DDR3_C_DM7: DS12.D3(UDM)
DDR3_C_DQ0: DS9.E3(DQ0)
DDR3_C_DQ1: DS9.F7(DQ1)
DDR3_C_DQ2: DS9.F2(DQ2)
DDR3_C_DQ3: DS9.F8(DQ3)
DDR3_C_DQ4: DS9.H3(DQ4)
DDR3_C_DQ5: DS9.H8(DQ5)
DDR3_C_DQ6: DS9.G2(DQ6)
DDR3_C_DQ7: DS9.H7(DQ7)
DDR3_C_DQ8: DS9.D7(DQ8)
DDR3_C_DQ9: DS9.C3(DQ9)
DDR3_C_DQ10: DS9.C8(DQ10)
DDR3_C_DQ11: DS9.C2(DQ11)
DDR3_C_DQ12: DS9.A7(DQ12)
DDR3_C_DQ13: DS9.A2(DQ13)
DDR3_C_DQ14: DS9.B8(DQ14)
DDR3_C_DQ15: DS9.A3(DQ15)
DDR3_C_DQ16: DS10.E3(DQ0)
DDR3_C_DQ17: DS10.F7(DQ1)
DDR3_C_DQ18: DS10.F2(DQ2)
DDR3_C_DQ19: DS10.F8(DQ3)
DDR3_C_DQ20: DS10.H3(DQ4)
DDR3_C_DQ21: DS10.H8(DQ5)
DDR3_C_DQ22: DS10.G2(DQ6)
DDR3_C_DQ23: DS10.H7(DQ7)
DDR3_C_DQ24: DS10.D7(DQ8)
DDR3_C_DQ25: DS10.C3(DQ9)
DDR3_C_DQ26: DS10.C8(DQ10)
DDR3_C_DQ27: DS10.C2(DQ11)
DDR3_C_DQ28: DS10.A7(DQ12)
DDR3_C_DQ29: DS10.A2(DQ13)
DDR3_C_DQ30: DS10.B8(DQ14)
DDR3_C_DQ31: DS10.A3(DQ15)
DDR3_C_DQ32: DS11.E3(DQ0)
DDR3_C_DQ33: DS11.F7(DQ1)
DDR3_C_DQ34: DS11.F2(DQ2)
DDR3_C_DQ35: DS11.F8(DQ3)
DDR3_C_DQ36: DS11.H3(DQ4)
DDR3_C_DQ37: DS11.H8(DQ5)
DDR3_C_DQ38: DS11.G2(DQ6)
DDR3_C_DQ39: DS11.H7(DQ7)
DDR3_C_DQ40: DS11.D7(DQ8)
DDR3_C_DQ41: DS11.C3(DQ9)
DDR3_C_DQ42: DS11.C8(DQ10)
DDR3_C_DQ43: DS11.C2(DQ11)
DDR3_C_DQ44: DS11.A7(DQ12)
DDR3_C_DQ45: DS11.A2(DQ13)
DDR3_C_DQ46: DS11.B8(DQ14)
DDR3_C_DQ47: DS11.A3(DQ15)
DDR3_C_DQ48: DS12.E3(DQ0)
DDR3_C_DQ49: DS12.F7(DQ1)
DDR3_C_DQ50: DS12.F2(DQ2)
DDR3_C_DQ51: DS12.F8(DQ3)
DDR3_C_DQ52: DS12.H3(DQ4)
DDR3_C_DQ53: DS12.H8(DQ5)
DDR3_C_DQ54: DS12.G2(DQ6)
DDR3_C_DQ55: DS12.H7(DQ7)
DDR3_C_DQ56: DS12.D7(DQ8)
DDR3_C_DQ57: DS12.C3(DQ9)
DDR3_C_DQ58: DS12.C8(DQ10)
DDR3_C_DQ59: DS12.C2(DQ11)
DDR3_C_DQ60: DS12.A7(DQ12)
DDR3_C_DQ61: DS12.A2(DQ13)
DDR3_C_DQ62: DS12.B8(DQ14)
DDR3_C_DQ63: DS12.A3(DQ15)
DDR3_C_DQS0_N: DS9.G3(LDQS#)
DDR3_C_DQS0_P: DS9.F3(LDQS)
DDR3_C_DQS1_N: DS9.B7(UDQS#)
DDR3_C_DQS1_P: DS9.C7(UDQS)
DDR3_C_DQS2_N: DS10.G3(LDQS#)
DDR3_C_DQS2_P: DS10.F3(LDQS)
DDR3_C_DQS3_N: DS10.B7(UDQS#)
DDR3_C_DQS3_P: DS10.C7(UDQS)
DDR3_C_DQS4_N: DS11.G3(LDQS#)
DDR3_C_DQS4_P: DS11.F3(LDQS)
DDR3_C_DQS5_N: DS11.B7(UDQS#)
DDR3_C_DQS5_P: DS11.C7(UDQS)
DDR3_C_DQS6_N: DS12.G3(LDQS#)
DDR3_C_DQS6_P: DS12.F3(LDQS)
DDR3_C_DQS7_N: DS12.B7(UDQS#)
DDR3_C_DQS7_P: DS12.C7(UDQS)
DDR3_C_nCAS: DS9.K3(CAS#) DS10.K3(CAS#) DS11.K3(CAS#) DS12.K3(CAS#)
DDR3_C_nCS: DS9.L2(CS#) DS10.L2(CS#) DS11.L2(CS#) DS12.L2(CS#)
DDR3_C_nRAS: DS9.J3(RAS#) DS10.J3(RAS#) DS11.J3(RAS#) DS12.J3(RAS#)
DDR3_C_nRST: DS9.T2(RESET#) DS10.T2(RESET#) DS11.T2(RESET#) DS12.T2(RESET#)
DDR3_C_nWE: DS9.L3(WE#) DS10.L3(WE#) DS11.L3(WE#) DS12.L3(WE#)
DDR3_C_ODT: DS9.K1(ODT) DS10.K1(ODT) DS11.K1(ODT) DS12.K1(ODT)

Not connected (* = marked no-connect by the designer): DS9 J1(NC) J9(NC) L1(NC) L9(NC) M7(NC); DS10 J1(NC) J9(NC) L1(NC) L9(NC) M7(NC); DS11 J1(NC) J9(NC) L1(NC) L9(NC) M7(NC); DS12 J1(NC) J9(NC) L1(NC) L9(NC) M7(NC)

### Notes on the sheet
- A(1)
- ОЗУ канал C
- A(3)
- 人
  工
  脳
- Перв. примен.
- Справ. №
- Подп. и дата
- Инв. № дубл.
- Взам. инв. №
- Инв. № подл.
- Изм.
- Лист
- № докум.
- Подп.
- Дата
- 2.106-A2
- Копировал
- Формат А2
- (in symbol MT41K256M16TW-107IT:P) DDR3L

### Library data of the parts
DS9-DS12 = MT41K256M16TW-107IT:P: as DS1 on sheet Э3-7; ComponentType: Микросхема; Install: 1

## Sheet Э3-10.SchDoc
size 594 x 420 mm; Address1: Address1; Address2: Address2; Address3: Address3; Address4: Address4; SheetNumber: 9; SheetTotal: 12; DocumentType: Схема электрическая принципиальная
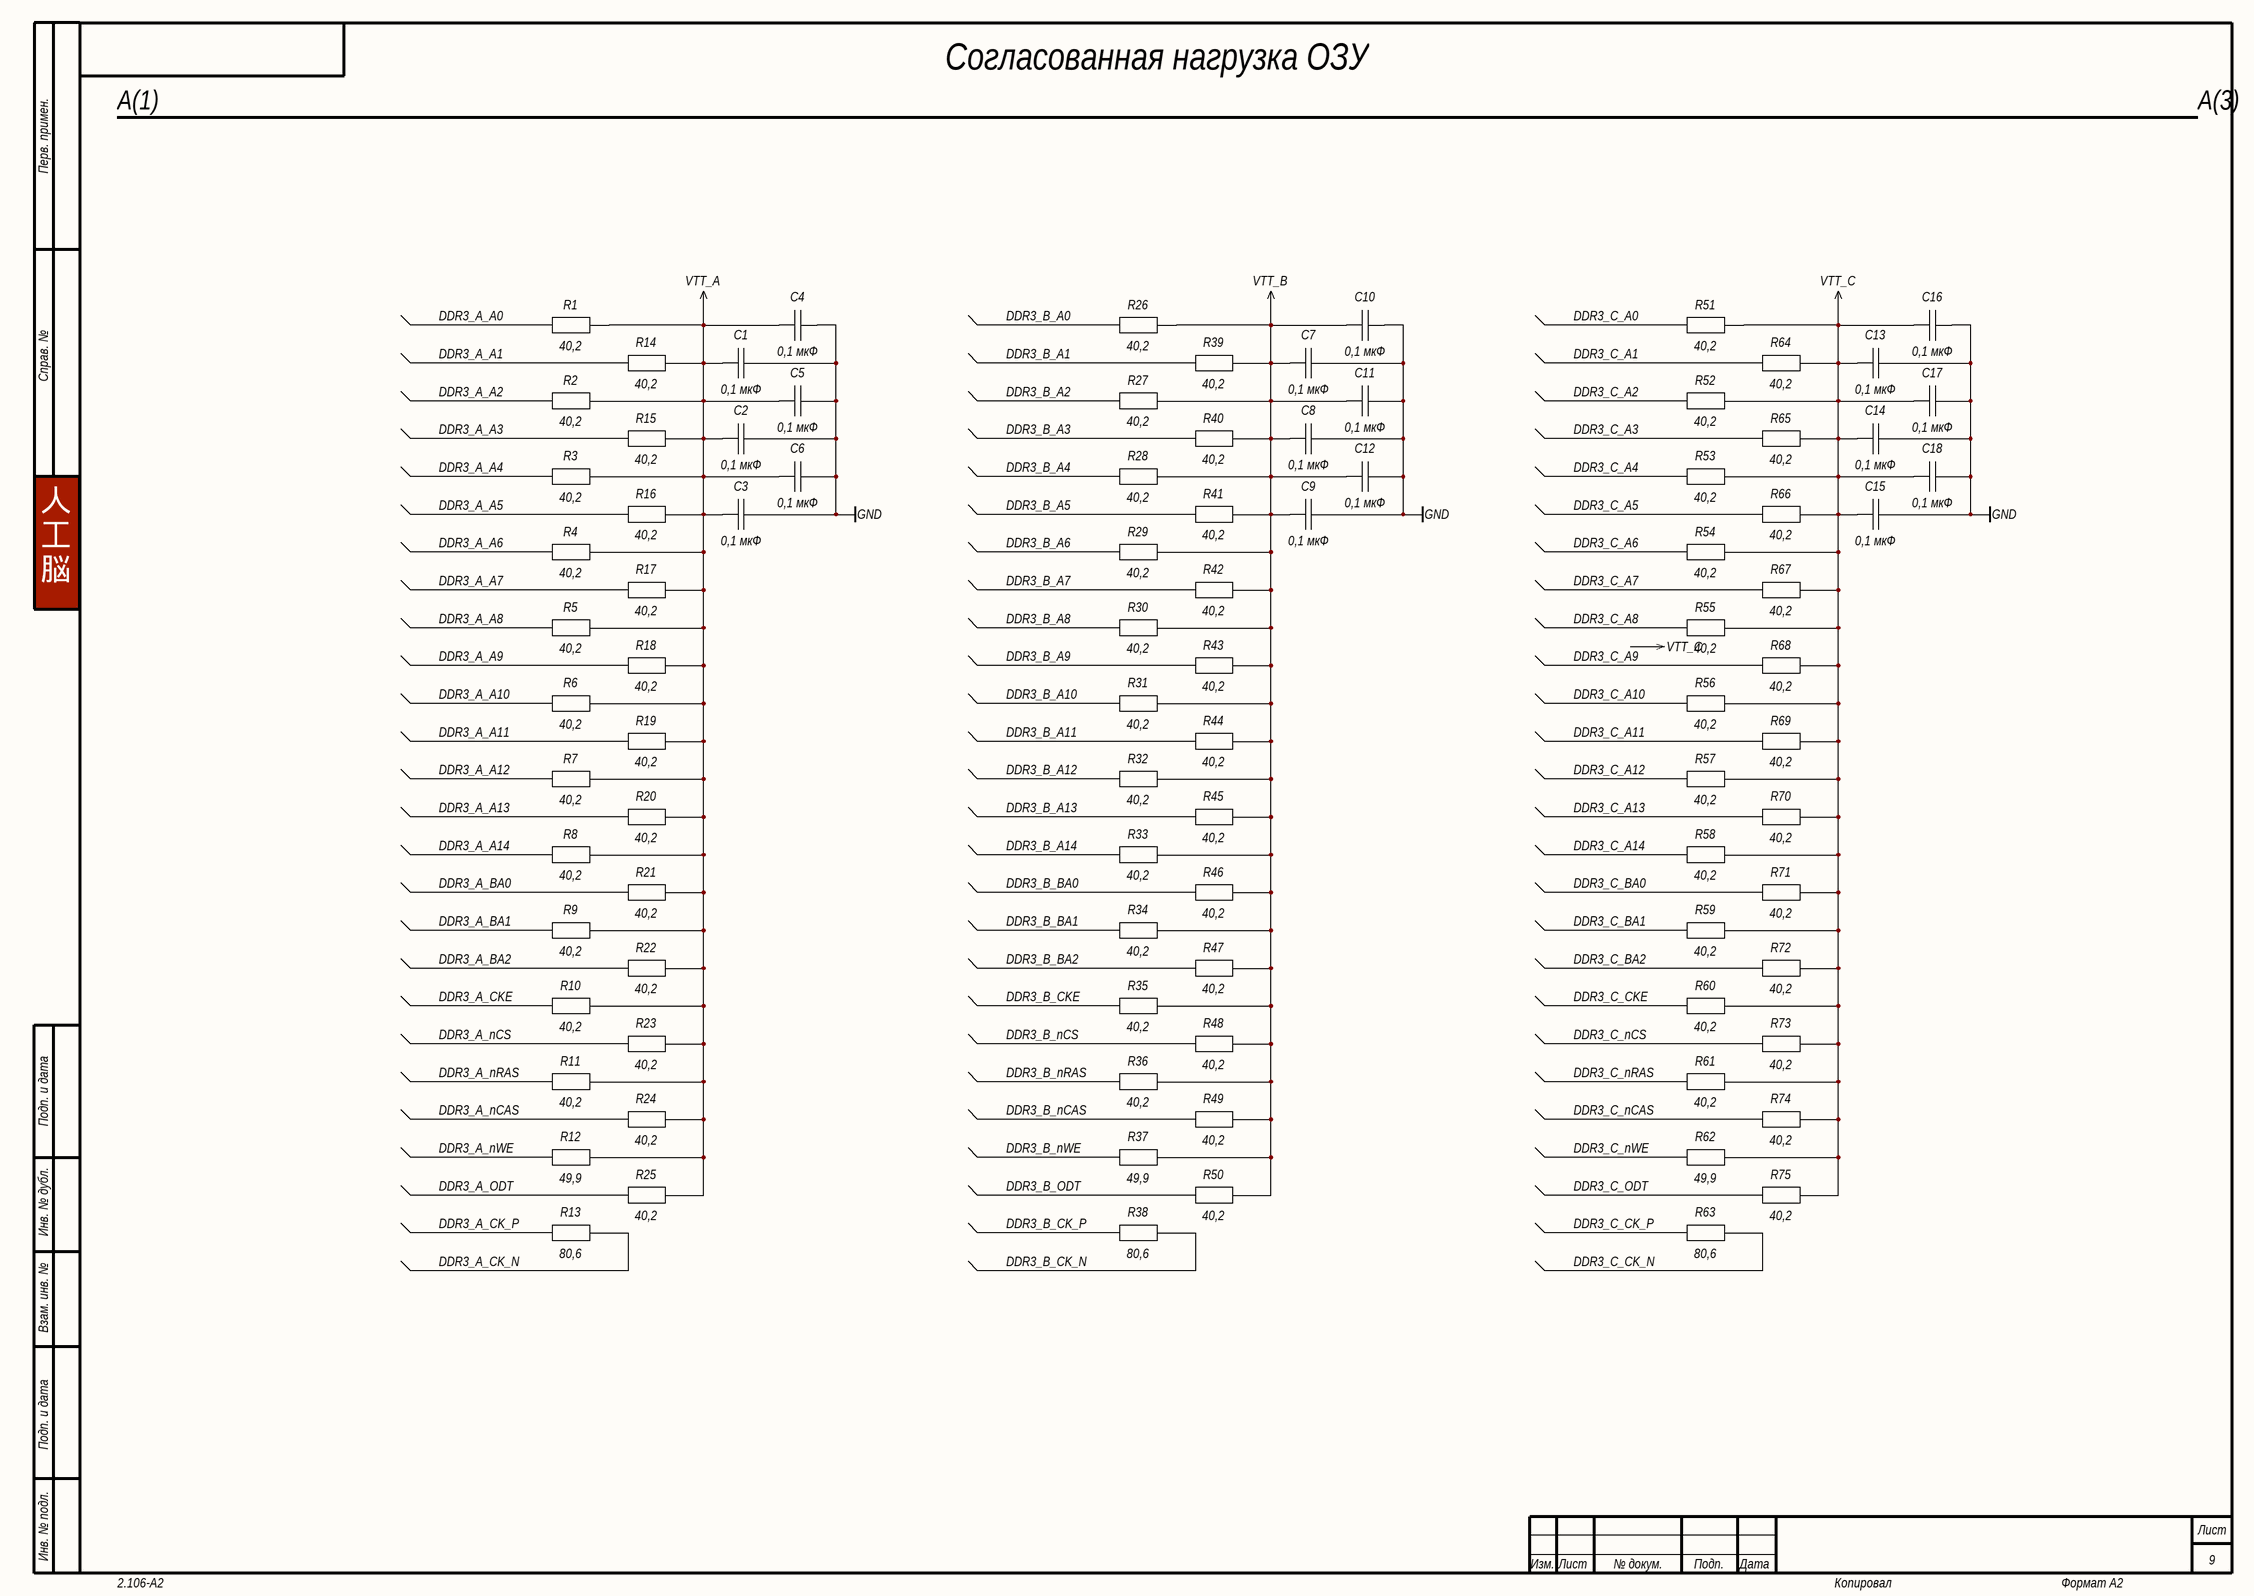
[diagram p8: Э3-10.SchDoc]

### Parts
C1  value 0,1 мкФ  [C0201-B-0.3mm]  (hidden comment: 1)
C2  value 0,1 мкФ  [C0201-B-0.3mm]  (hidden comment: 1)
C3  value 0,1 мкФ  [C0201-B-0.3mm]  (hidden comment: 1)
C4  value 0,1 мкФ  [C0201-B-0.3mm]  (hidden comment: 1)
C5  value 0,1 мкФ  [C0201-B-0.3mm]  (hidden comment: 1)
C6  value 0,1 мкФ  [C0201-B-0.3mm]  (hidden comment: 1)
C7  value 0,1 мкФ  [C0201-B-0.3mm]  (hidden comment: 1)
C8  value 0,1 мкФ  [C0201-B-0.3mm]  (hidden comment: 1)
C9  value 0,1 мкФ  [C0201-B-0.3mm]  (hidden comment: 1)
C10  value 0,1 мкФ  [C0201-B-0.3mm]  (hidden comment: 1)
C11  value 0,1 мкФ  [C0201-B-0.3mm]  (hidden comment: 1)
C12  value 0,1 мкФ  [C0201-B-0.3mm]  (hidden comment: 1)
C13  value 0,1 мкФ  [C0201-B-0.3mm]  (hidden comment: 1)
C14  value 0,1 мкФ  [C0201-B-0.3mm]  (hidden comment: 1)
C15  value 0,1 мкФ  [C0201-B-0.3mm]  (hidden comment: 1)
C16  value 0,1 мкФ  [C0201-B-0.3mm]  (hidden comment: 1)
C17  value 0,1 мкФ  [C0201-B-0.3mm]  (hidden comment: 1)
C18  value 0,1 мкФ  [C0201-B-0.3mm]  (hidden comment: 1)
R1  value 40,2  [CR0201-B-0.25mm]  (hidden comment: 1)
R2  value 40,2  [CR0201-B-0.25mm]  (hidden comment: 1)
R3  value 40,2  [CR0201-B-0.25mm]  (hidden comment: 1)
R4  value 40,2  [CR0201-B-0.25mm]  (hidden comment: 1)
R5  value 40,2  [CR0201-B-0.25mm]  (hidden comment: 1)
R6  value 40,2  [CR0201-B-0.25mm]  (hidden comment: 1)
R7  value 40,2  [CR0201-B-0.25mm]  (hidden comment: 1)
R8  value 40,2  [CR0201-B-0.25mm]  (hidden comment: 1)
R9  value 40,2  [CR0201-B-0.25mm]  (hidden comment: 1)
R10  value 40,2  [CR0201-B-0.25mm]  (hidden comment: 1)
R11  value 40,2  [CR0201-B-0.25mm]  (hidden comment: 1)
R12  value 49,9  [CR0201-B-0.25mm]  (hidden comment: 1)
R13  value 80,6  [CR0201-B-0.25mm]  (hidden comment: 1)
R14  value 40,2  [CR0201-B-0.25mm]  (hidden comment: 1)
R15  value 40,2  [CR0201-B-0.25mm]  (hidden comment: 1)
R16  value 40,2  [CR0201-B-0.25mm]  (hidden comment: 1)
R17  value 40,2  [CR0201-B-0.25mm]  (hidden comment: 1)
R18  value 40,2  [CR0201-B-0.25mm]  (hidden comment: 1)
R19  value 40,2  [CR0201-B-0.25mm]  (hidden comment: 1)
R20  value 40,2  [CR0201-B-0.25mm]  (hidden comment: 1)
R21  value 40,2  [CR0201-B-0.25mm]  (hidden comment: 1)
R22  value 40,2  [CR0201-B-0.25mm]  (hidden comment: 1)
R23  value 40,2  [CR0201-B-0.25mm]  (hidden comment: 1)
R24  value 40,2  [CR0201-B-0.25mm]  (hidden comment: 1)
R25  value 40,2  [CR0201-B-0.25mm]  (hidden comment: 1)
R26  value 40,2  [CR0201-B-0.25mm]  (hidden comment: 1)
R27  value 40,2  [CR0201-B-0.25mm]  (hidden comment: 1)
R28  value 40,2  [CR0201-B-0.25mm]  (hidden comment: 1)
R29  value 40,2  [CR0201-B-0.25mm]  (hidden comment: 1)
R30  value 40,2  [CR0201-B-0.25mm]  (hidden comment: 1)
R31  value 40,2  [CR0201-B-0.25mm]  (hidden comment: 1)
R32  value 40,2  [CR0201-B-0.25mm]  (hidden comment: 1)
R33  value 40,2  [CR0201-B-0.25mm]  (hidden comment: 1)
R34  value 40,2  [CR0201-B-0.25mm]  (hidden comment: 1)
R35  value 40,2  [CR0201-B-0.25mm]  (hidden comment: 1)
R36  value 40,2  [CR0201-B-0.25mm]  (hidden comment: 1)
R37  value 49,9  [CR0201-B-0.25mm]  (hidden comment: 1)
R38  value 80,6  [CR0201-B-0.25mm]  (hidden comment: 1)
R39  value 40,2  [CR0201-B-0.25mm]  (hidden comment: 1)
R40  value 40,2  [CR0201-B-0.25mm]  (hidden comment: 1)
R41  value 40,2  [CR0201-B-0.25mm]  (hidden comment: 1)
R42  value 40,2  [CR0201-B-0.25mm]  (hidden comment: 1)
R43  value 40,2  [CR0201-B-0.25mm]  (hidden comment: 1)
R44  value 40,2  [CR0201-B-0.25mm]  (hidden comment: 1)
R45  value 40,2  [CR0201-B-0.25mm]  (hidden comment: 1)
R46  value 40,2  [CR0201-B-0.25mm]  (hidden comment: 1)
R47  value 40,2  [CR0201-B-0.25mm]  (hidden comment: 1)
R48  value 40,2  [CR0201-B-0.25mm]  (hidden comment: 1)
R49  value 40,2  [CR0201-B-0.25mm]  (hidden comment: 1)
R50  value 40,2  [CR0201-B-0.25mm]  (hidden comment: 1)
R51  value 40,2  [CR0201-B-0.25mm]  (hidden comment: 1)
R52  value 40,2  [CR0201-B-0.25mm]  (hidden comment: 1)
R53  value 40,2  [CR0201-B-0.25mm]  (hidden comment: 1)
R54  value 40,2  [CR0201-B-0.25mm]  (hidden comment: 1)
R55  value 40,2  [CR0201-B-0.25mm]  (hidden comment: 1)
R56  value 40,2  [CR0201-B-0.25mm]  (hidden comment: 1)
R57  value 40,2  [CR0201-B-0.25mm]  (hidden comment: 1)
R58  value 40,2  [CR0201-B-0.25mm]  (hidden comment: 1)
R59  value 40,2  [CR0201-B-0.25mm]  (hidden comment: 1)
R60  value 40,2  [CR0201-B-0.25mm]  (hidden comment: 1)
R61  value 40,2  [CR0201-B-0.25mm]  (hidden comment: 1)
R62  value 49,9  [CR0201-B-0.25mm]  (hidden comment: 1)
R63  value 80,6  [CR0201-B-0.25mm]  (hidden comment: 1)
R64  value 40,2  [CR0201-B-0.25mm]  (hidden comment: 1)
R65  value 40,2  [CR0201-B-0.25mm]  (hidden comment: 1)
R66  value 40,2  [CR0201-B-0.25mm]  (hidden comment: 1)
R67  value 40,2  [CR0201-B-0.25mm]  (hidden comment: 1)
R68  value 40,2  [CR0201-B-0.25mm]  (hidden comment: 1)
R69  value 40,2  [CR0201-B-0.25mm]  (hidden comment: 1)
R70  value 40,2  [CR0201-B-0.25mm]  (hidden comment: 1)
R71  value 40,2  [CR0201-B-0.25mm]  (hidden comment: 1)
R72  value 40,2  [CR0201-B-0.25mm]  (hidden comment: 1)
R73  value 40,2  [CR0201-B-0.25mm]  (hidden comment: 1)
R74  value 40,2  [CR0201-B-0.25mm]  (hidden comment: 1)
R75  value 40,2  [CR0201-B-0.25mm]  (hidden comment: 1)

### Nets
GND: C1.2 C2.2 C3.2 C4.2 C5.2 C6.2 C7.2 C8.2 C9.2 C10.2 C11.2 C12.2 C13.2 C14.2 C15.2 C16.2 C17.2 C18.2
VTT_A: C1.1 C2.1 C3.1 C4.1 C5.1 C6.1 R1.2 R2.2 R3.2 R4.2 R5.2 R6.2 R7.2 R8.2 R9.2 R10.2 R11.2 R12.2 R14.2 R15.2 R16.2 R17.2 R18.2 R19.2 R20.2 R21.2 R22.2 R23.2 R24.2 R25.2
VTT_B: C7.1 C8.1 C9.1 C10.1 C11.1 C12.1 R26.2 R27.2 R28.2 R29.2 R30.2 R31.2 R32.2 R33.2 R34.2 R35.2 R36.2 R37.2 R39.2 R40.2 R41.2 R42.2 R43.2 R44.2 R45.2 R46.2 R47.2 R48.2 R49.2 R50.2
VTT_C: C13.1 C14.1 C15.1 C16.1 C17.1 C18.1 R51.2 R52.2 R53.2 R54.2 R55.2 R56.2 R57.2 R58.2 R59.2 R60.2 R61.2 R62.2 R64.2 R65.2 R66.2 R67.2 R68.2 R69.2 R70.2 R71.2 R72.2 R73.2 R74.2 R75.2
DDR3_A_A0: R1.1
DDR3_A_A1: R14.1
DDR3_A_A2: R2.1
DDR3_A_A3: R15.1
DDR3_A_A4: R3.1
DDR3_A_A5: R16.1
DDR3_A_A6: R4.1
DDR3_A_A7: R17.1
DDR3_A_A8: R5.1
DDR3_A_A9: R18.1
DDR3_A_A10: R6.1
DDR3_A_A11: R19.1
DDR3_A_A12: R7.1
DDR3_A_A13: R20.1
DDR3_A_A14: R8.1
DDR3_A_BA0: R21.1
DDR3_A_BA1: R9.1
DDR3_A_BA2: R22.1
DDR3_A_CK_N: R13.2
DDR3_A_CK_P: R13.1
DDR3_A_CKE: R10.1
DDR3_A_nCAS: R24.1
DDR3_A_nCS: R23.1
DDR3_A_nRAS: R11.1
DDR3_A_nWE: R12.1
DDR3_A_ODT: R25.1
DDR3_B_A0: R26.1
DDR3_B_A1: R39.1
DDR3_B_A2: R27.1
DDR3_B_A3: R40.1
DDR3_B_A4: R28.1
DDR3_B_A5: R41.1
DDR3_B_A6: R29.1
DDR3_B_A7: R42.1
DDR3_B_A8: R30.1
DDR3_B_A9: R43.1
DDR3_B_A10: R31.1
DDR3_B_A11: R44.1
DDR3_B_A12: R32.1
DDR3_B_A13: R45.1
DDR3_B_A14: R33.1
DDR3_B_BA0: R46.1
DDR3_B_BA1: R34.1
DDR3_B_BA2: R47.1
DDR3_B_CK_N: R38.2
DDR3_B_CK_P: R38.1
DDR3_B_CKE: R35.1
DDR3_B_nCAS: R49.1
DDR3_B_nCS: R48.1
DDR3_B_nRAS: R36.1
DDR3_B_nWE: R37.1
DDR3_B_ODT: R50.1
DDR3_C_A0: R51.1
DDR3_C_A1: R64.1
DDR3_C_A2: R52.1
DDR3_C_A3: R65.1
DDR3_C_A4: R53.1
DDR3_C_A5: R66.1
DDR3_C_A6: R54.1
DDR3_C_A7: R67.1
DDR3_C_A8: R55.1
DDR3_C_A9: R68.1
DDR3_C_A10: R56.1
DDR3_C_A11: R69.1
DDR3_C_A12: R57.1
DDR3_C_A13: R70.1
DDR3_C_A14: R58.1
DDR3_C_BA0: R71.1
DDR3_C_BA1: R59.1
DDR3_C_BA2: R72.1
DDR3_C_CK_N: R63.2
DDR3_C_CK_P: R63.1
DDR3_C_CKE: R60.1
DDR3_C_nCAS: R74.1
DDR3_C_nCS: R73.1
DDR3_C_nRAS: R61.1
DDR3_C_nWE: R62.1
DDR3_C_ODT: R75.1

### Notes on the sheet
- A(1)
- Согласованная нагрузка ОЗУ
- A(3)
- 人
  工
  脳
- Перв. примен.
- Справ. №
- Подп. и дата
- Инв. № дубл.
- Взам. инв. №
- Инв. № подл.
- Изм.
- Лист
- № докум.
- Подп.
- Дата
- 2.106-A2
- Копировал
- Формат А2

### Library data of the parts
C1-C18 = Non Polar Hor.: TemperatureRange: -...+°C; ComponentType: Конденсатор; Install: 1
R1-R75 = Resistor Hor.: TemperatureRange: -...+°C; ComponentType: Резистор; Install: 1